# EAGLE design octanis_eps_mcu_shdn (EAGLE 7.1.0)
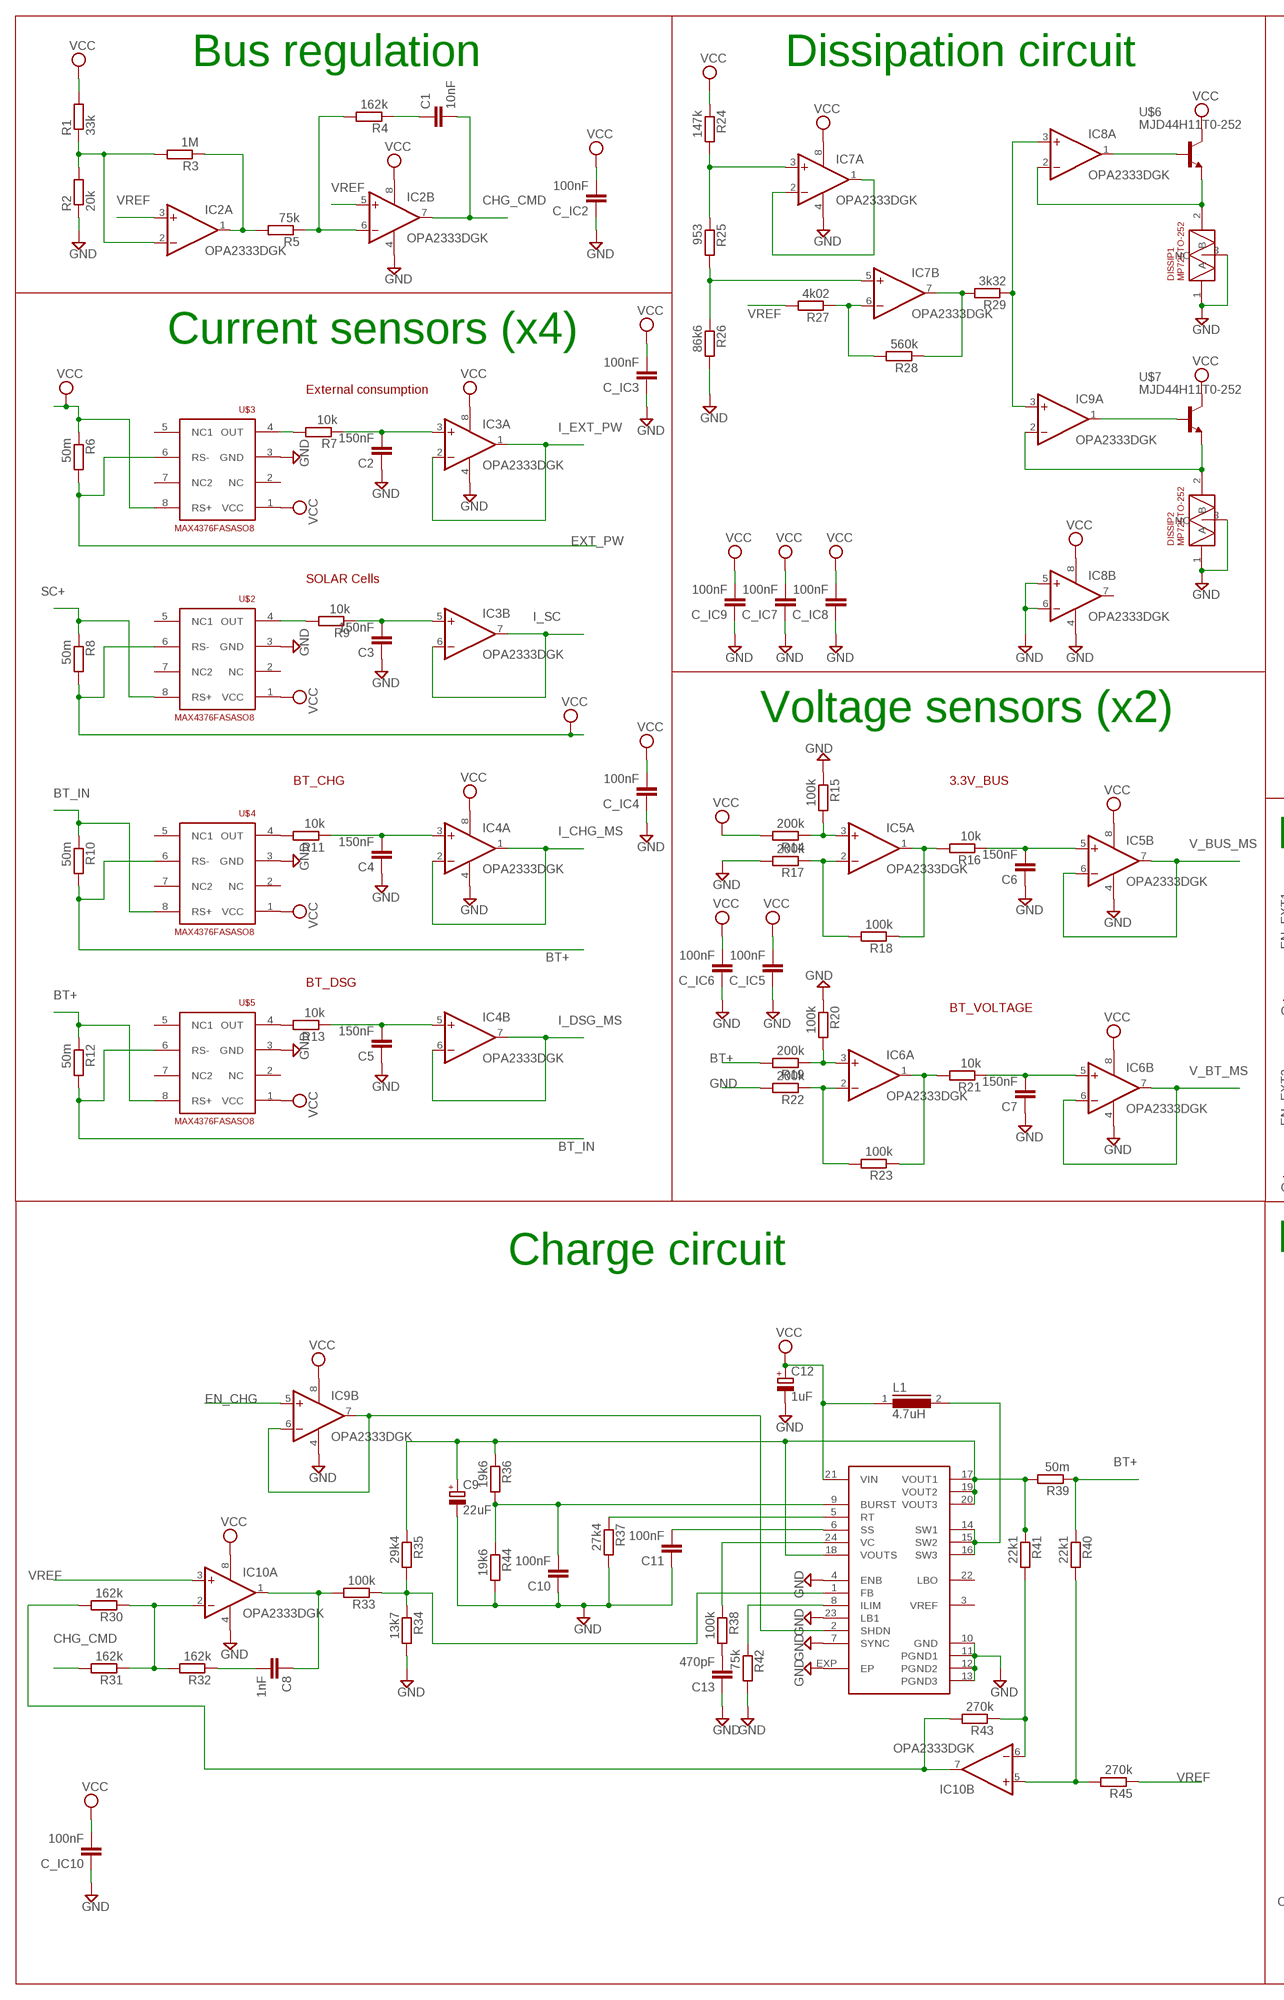
[diagram p0: schematic, sheet 1, part 1 of 2]
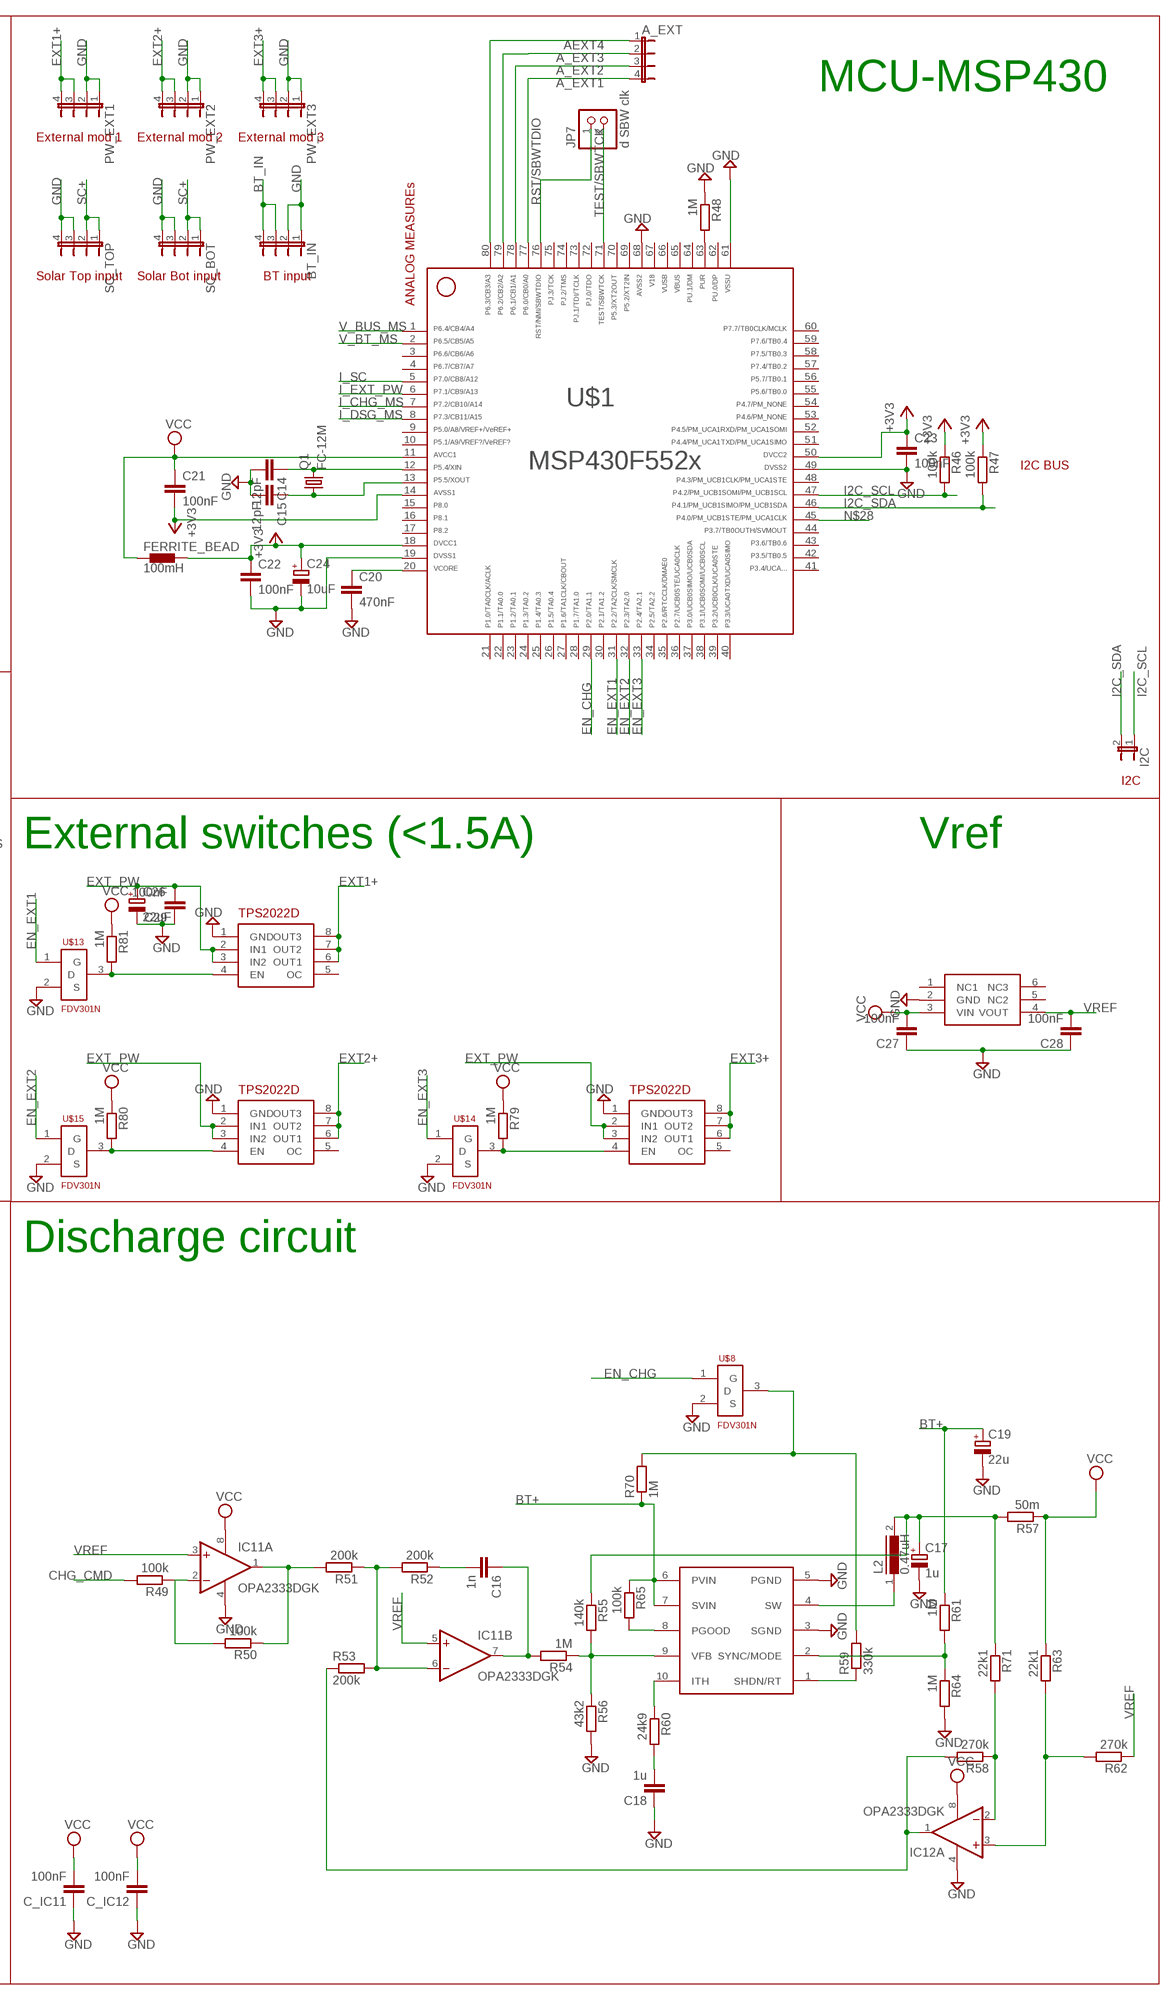
[diagram p1: schematic, sheet 1, part 2 of 2]

## Parts
A_EXT  JP4E  [JP4]
BT_IN  JP4E  [JP4]
C1  10nF  C-EUC0603  [C0603]
C2  150nF  C-EUC0603  [C0603]
C3  150nF  C-EUC0603  [C0603]
C4  150nF  C-EUC0603  [C0603]
C5  150nF  C-EUC0603  [C0603]
C6  150nF  C-EUC0603  [C0603]
C7  150nF  C-EUC0603  [C0603]
C8  1nF  C-EUC0603  [C0603]
C9  22uF  CPOL-EUA/3216-18R  [A/3216-18R]
C10  100nF  C-EUC0603  [C0603]
C11  100nF  C-EUC0603  [C0603]
C12  1uF  CPOL-EUA/3216-18R  [A/3216-18R]
C13  470pF  C-EUC0603  [C0603]
C14  12pF  C-EUC0603  [C0603]
C15  12pF  C-EUC0603  [C0603]
C16  1n  C-EUC0603  [C0603]
C17  1u  CPOL-EUA/3216-18R  [A/3216-18R]
C18  1u  C-EUC0603  [C0603]
C19  22u  CPOL-EUA/3216-18R  [A/3216-18R]
C20  470nF  C-EUC0603  [C0603]
C21  100nF  C-EUC0603  [C0603]
C22  100nF  C-EUC0603  [C0603]
C23  100nF  C-EUC0603  [C0603]
C24  10uF  CPOL-EUA/3216-18R  [A/3216-18R]
C26  22uF  CPOL-EUA/3216-18R  [A/3216-18R]
C27  100nF  C-EUC0603  [C0603]
C28  100nF  C-EUC0603  [C0603]
C29  100nF  C-EUC0603  [C0603]
C_IC2  100nF  C-EUC0603  [C0603]
C_IC3  100nF  C-EUC0603  [C0603]
C_IC4  100nF  C-EUC0603  [C0603]
C_IC5  100nF  C-EUC0603  [C0603]
C_IC6  100nF  C-EUC0603  [C0603]
C_IC7  100nF  C-EUC0603  [C0603]
C_IC8  100nF  C-EUC0603  [C0603]
C_IC9  100nF  C-EUC0603  [C0603]
C_IC10  100nF  C-EUC0603  [C0603]
C_IC11  100nF  C-EUC0603  [C0603]
C_IC12  100nF  C-EUC0603  [C0603]
DISSIP1  MP725TO-252  [TO252]
DISSIP2  MP725TO-252  [TO252]
FERRITE_BEAD  100mH  BLM15HD601SN1  [0402]
I2C  JP1E  [JP1]
IC2  OPA2333DGK  [MSOP08]
IC3  OPA2333DGK  [MSOP08]
IC4  OPA2333DGK  [MSOP08]
IC5  OPA2333DGK  [MSOP08]
IC6  OPA2333DGK  [MSOP08]
IC7  OPA2333DGK  [MSOP08]
IC8  OPA2333DGK  [MSOP08]
IC9  OPA2333DGK  [MSOP08]
IC10  OPA2333DGK  [MSOP08]
IC11  OPA2333DGK  [MSOP08]
IC12  OPA2333DGK  [MSOP08]
JP7  d SBW clk  PINHD-1X2  [1X02]
L1  4.7uH  DR73  [DR73]
L2  0.47uH  DR73  [DR73]
LTC3411  LT3411  [MSOP10]
PW_EXT1  JP4E  [JP4]
PW_EXT2  JP4E  [JP4]
PW_EXT3  JP4E  [JP4]
Q1  FC-12M  [FC-12M]
R1  33k  R-EU_R0603  [R0603]
R2  20k  R-EU_R0603  [R0603]
R3  1M  R-EU_R0603  [R0603]
R4  162k  R-EU_R0603  [R0603]
R5  75k  R-EU_R0603  [R0603]
R6  50m  R-EU_R1206  [R1206]
R7  10k  R-EU_R0603  [R0603]
R8  50m  R-EU_R1206  [R1206]
R9  10k  R-EU_R0603  [R0603]
R10  50m  R-EU_R1206  [R1206]
R11  10k  R-EU_R0603  [R0603]
R12  50m  R-EU_R1206  [R1206]
R13  10k  R-EU_R0603  [R0603]
R14  200k  R-EU_R0603  [R0603]
R15  100k  R-EU_R0603  [R0603]
R16  10k  R-EU_R0603  [R0603]
R17  200k  R-EU_R0603  [R0603]
R18  100k  R-EU_R0603  [R0603]
R19  200k  R-EU_R0603  [R0603]
R20  100k  R-EU_R0603  [R0603]
R21  10k  R-EU_R0603  [R0603]
R22  200k  R-EU_R0603  [R0603]
R23  100k  R-EU_R0603  [R0603]
R24  147k  R-EU_R0603  [R0603]
R25  953  R-EU_R0603  [R0603]
R26  86k6  R-EU_R0603  [R0603]
R27  4k02  R-EU_R0603  [R0603]
R28  560k  R-EU_R0603  [R0603]
R29  3k32  R-EU_R0603  [R0603]
R30  162k  R-EU_R0603  [R0603]
R31  162k  R-EU_R0603  [R0603]
R32  162k  R-EU_R0603  [R0603]
R33  100k  R-EU_R0603  [R0603]
R34  13k7  R-EU_R0603  [R0603]
R35  29k4  R-EU_R0603  [R0603]
R36  19k6  R-EU_R0603  [R0603]
R37  27k4  R-EU_R0603  [R0603]
R38  100k  R-EU_R0603  [R0603]
R39  50m  R-EU_R1206  [R1206]
R40  22k1  R-EU_R0603  [R0603]
R41  22k1  R-EU_R0603  [R0603]
R42  75k  R-EU_R0603  [R0603]
R43  270k  R-EU_R0603  [R0603]
R44  19k6  R-EU_R0603  [R0603]
R45  270k  R-EU_R0603  [R0603]
R46  100k  R-EU_R0603  [R0603]
R47  100k  R-EU_R0603  [R0603]
R48  1M  R-EU_R0603  [R0603]
R49  100k  R-EU_R0603  [R0603]
R50  100k  R-EU_R0603  [R0603]
R51  200k  R-EU_R0603  [R0603]
R52  200k  R-EU_R0603  [R0603]
R53  200k  R-EU_R0603  [R0603]
R54  1M  R-EU_R0603  [R0603]
R55  140k  R-EU_R0603  [R0603]
R56  43k2  R-EU_R0603  [R0603]
R57  50m  R-EU_R1206  [R1206]
R58  270k  R-EU_R0603  [R0603]
R59  330k  R-EU_R0603  [R0603]
R60  24k9  R-EU_R0603  [R0603]
R61  1M  R-EU_R0603  [R0603]
R62  270k  R-EU_R0603  [R0603]
R63  22k1  R-EU_R0603  [R0603]
R64  1M  R-EU_R0603  [R0603]
R65  100k  R-EU_R0603  [R0603]
R70  1M  R-EU_R0603  [R0603]
R71  22k1  R-EU_R0603  [R0603]
R79  1M  R-EU_R0603  [R0603]
R80  1M  R-EU_R0603  [R0603]
R81  1M  R-EU_R0603  [R0603]
SC_BOT  JP4E  [JP4]
SC_TOP  JP4E  [JP4]
U$1  F552X---PN80  [PN80]
U$2  MAX4376FASASO8  [SO8]
U$3  MAX4376FASASO8  [SO8]
U$4  MAX4376FASASO8  [SO8]
U$5  MAX4376FASASO8  [SO8]
U$6  MJD44H11T0-252  [TO252]
U$7  MJD44H11T0-252  [TO252]
U$8  FDV301N  [SOT23]
U$11  LTC3421  [QFN24]
U$13  FDV301N  [SOT23]
U$14  FDV301N  [SOT23]
U$15  FDV301N  [SOT23]
U$16  TPS2022D  [SO8]
U$17  TPS2022D  [SO8]
U$18  TPS2022D  [SO8]
U$19  ADR127B  [TSOT23-6]

## Nets
+3V3: C21.2 C22.1 C23.1 C24.+ FERRITE_BEAD.2 R46.1 R47.1 U$1.14 U$1.18 U$1.50
A_EXT1: A_EXT.4 U$1.77
A_EXT2: A_EXT.3 U$1.78
A_EXT3: A_EXT.2 U$1.79
AEXT4: A_EXT.1 U$1.80
BT+: C19.+ LTC3411.6(PVIN) LTC3411.7(SVIN) R10.2 R12.1 R19.2 R39.1 R40.1 R61.1 R65.1 R70.1 U$4.6(RS-) U$5.8(RS+)
BT_IN: BT_IN.3 BT_IN.4 R10.1 R12.2 U$4.8(RS+) U$5.6(RS-)
CHG_CMD: C1.2 IC2.7(B:OUT) R31.2 R49.2
EN_CHG: IC9.5(B:+IN) U$1.29 U$8.1(G)
EN_EXT1: U$1.31 U$13.1(G)
EN_EXT2: U$1.32 U$15.1(G)
EN_EXT3: U$1.33 U$14.1(G)
EXT1+: PW_EXT1.3 PW_EXT1.4 U$16.6(OUT1) U$16.7(OUT2) U$16.8(OUT3)
EXT2+: PW_EXT2.3 PW_EXT2.4 U$17.6(OUT1) U$17.7(OUT2) U$17.8(OUT3)
EXT3+: PW_EXT3.3 PW_EXT3.4 U$18.6(OUT1) U$18.7(OUT2) U$18.8(OUT3)
EXT_PW: C26.+ C29.2 R6.2 U$3.6(RS-) U$16.2(IN1) U$16.3(IN2) U$17.2(IN1) U$17.3(IN2) U$18.2(IN1) U$18.3(IN2)
GND: BT_IN.1 BT_IN.2 C2.1 C3.1 C4.1 C5.1 C6.1 C7.1 C9.- C10.1 C11.1 C12.- C13.1 C14.2 C15.2 C17.- C18.1 C19.- C20.2 C22.2 C23.2 C24.- C26.- C27.1 C28.1 C29.1 C_IC2.1 C_IC3.1 C_IC4.1 C_IC5.1 C_IC6.1 C_IC7.1 C_IC8.1 C_IC9.1 C_IC10.1 C_IC11.1 C_IC12.1 DISSIP1.1(A) DISSIP1.3(NC) DISSIP2.1(A) DISSIP2.3(NC) IC2.4(P:V-) IC3.4(P:V-) IC4.4(P:V-) IC5.4(P:V-) IC6.4(P:V-) IC7.4(P:V-) IC8.4(P:V-) IC8.5(B:+IN) IC8.6(B:-IN) IC9.4(P:V-) IC10.4(P:V-) IC11.4(P:V-) IC12.4(P:V-) LTC3411.3(SGND) LTC3411.5(PGND) PW_EXT1.1 PW_EXT1.2 PW_EXT2.1 PW_EXT2.2 PW_EXT3.1 PW_EXT3.2 R2.1 R15.1 R17.2 R20.1 R22.2 R26.2 R34.2 R37.2 R42.2 R44.2 R48.1 R56.2 R64.2 SC_BOT.3 SC_BOT.4 SC_TOP.3 SC_TOP.4 U$1.19 U$1.49 U$1.61 U$1.68 U$2.3(GND) U$3.3(GND) U$4.3(GND) U$5.3(GND) U$8.2(S) U$11.4(ENB) U$11.7(SYNC) U$11.10(GND) U$11.11(PGND1) U$11.12(PGND2) U$11.13(PGND3) U$11.23(LB1) U$11.EXP(EP) U$13.2(S) U$14.2(S) U$15.2(S) U$16.1(GND) U$17.1(GND) U$18.1(GND) U$19.2(GND)
I2C_SCL: I2C.1 R46.2 U$1.47
I2C_SDA: I2C.2 R47.2 U$1.46
I_CHG_MS: IC4.1(A:OUT) IC4.2(A:-IN) U$1.7
I_DSG_MS: IC4.6(B:-IN) IC4.7(B:OUT) U$1.8
I_EXT_PW: IC3.1(A:OUT) IC3.2(A:-IN) U$1.6
I_SC: IC3.6(B:-IN) IC3.7(B:OUT) U$1.5
N$1: IC2.2(A:-IN) R1.1 R2.2 R3.2
N$2: IC2.1(A:OUT) R3.1 R5.2
N$3: C1.1 R4.1
N$4: IC2.6(B:-IN) R4.2 R5.1
N$5: C4.2 IC4.3(A:+IN) R11.1
N$6: C2.2 IC3.3(A:+IN) R7.1
N$7: C3.2 IC3.5(B:+IN) R9.1
N$8: C5.2 IC4.5(B:+IN) R13.1
N$9: C7.2 IC6.5(B:+IN) R21.1
N$10: IC6.1(A:OUT) R21.2 R23.1
N$11: C6.2 IC5.5(B:+IN) R16.1
N$12: IC5.1(A:OUT) R16.2 R18.1
N$13: IC5.2(A:-IN) R17.1 R18.2
N$14: IC5.3(A:+IN) R14.1 R15.2
N$15: IC6.2(A:-IN) R22.1 R23.2
N$16: IC6.3(A:+IN) R19.1 R20.2
N$17: IC7.1(A:OUT) IC7.2(A:-IN)
N$18: IC7.3(A:+IN) R24.2 R25.1
N$19: IC7.5(B:+IN) R25.2 R26.1
N$20: IC7.6(B:-IN) R27.1 R28.2
N$21: IC7.7(B:OUT) R28.1 R29.2
N$22: IC8.3(A:+IN) IC9.3(A:+IN) R29.1
N$23: IC10.2(A:-IN) R30.1 R31.1 R32.2
N$24: C8.2 R32.1
N$25: C8.1 IC10.1(A:OUT) R33.2
N$26: R33.1 R34.1 R35.2 U$11.1(FB)
N$27: R48.2 U$1.63
N$28: U$1.45
N$29: R42.1 U$11.8(ILIM)
N$30: C10.2 R36.2 R44.1 U$11.9(BURST)
N$31: C13.2 R38.2
N$32: R37.1 U$11.5(RT)
N$33: C11.2 U$11.6(SS)
N$34: R80.2 U$15.3(D) U$17.4(EN)
N$35: C18.2 R60.2
N$36: R38.1 U$11.24(VC)
N$37: IC9.6(B:-IN) IC9.7(B:OUT) U$11.2(SHDN)
N$38: IC10.5(B:+IN) R40.2 R45.2
N$39: IC10.6(B:-IN) R41.2 R43.1
N$40: R9.2 U$2.4(OUT)
N$41: R11.2 U$4.4(OUT)
N$42: R7.2 U$3.4(OUT)
N$43: R13.2 U$5.4(OUT)
N$44: IC8.1(A:OUT) U$6.1(B)
N$45: IC9.1(A:OUT) U$7.1(B)
N$46: DISSIP2.2(B) IC9.2(A:-IN) U$7.3(E)
N$47: DISSIP1.2(B) IC8.2(A:-IN) U$6.3(E)
N$48: C14.1 Q1.2 U$1.12
N$49: C20.1 U$1.20
N$50: C15.1 Q1.1 U$1.13
N$51: C16.1 IC11.7(B:OUT) R54.2
N$52: IC11.2(A:-IN) R49.1 R50.2
N$53: IC11.1(A:OUT) R50.1 R51.2
N$54: IC11.6(B:-IN) R51.1 R52.2 R53.2
N$55: C16.2 R52.1
N$56: IC12.1(A:OUT) R53.1 R58.2
N$57: LTC3411.9(VFB) R54.1 R55.2 R56.1
N$58: C17.+ L2.2 R55.1 R57.2 R71.1
N$59: LTC3411.10(ITH) R60.1
N$60: LTC3411.2(SYNC/MODE) R61.2 R64.1
N$61: IC12.2(A:-IN) R58.1 R71.2
N$62: LTC3411.1(SHDN/RT) R59.1
N$63: IC12.3(A:+IN) R62.2 R63.2
N$64: LTC3411.8(PGOOD) R65.2
N$65: R59.2 R70.2 U$8.3(D)
N$75: C9.+ R35.1 R36.1 R39.2 R41.1 U$11.17(VOUT1) U$11.18(VOUTS) U$11.19(VOUT2) U$11.20(VOUT3)
N$77: L2.1 LTC3411.4(SW)
N$78: L1.2 U$11.14(SW1) U$11.15(SW2) U$11.16(SW3)
N$79: R81.2 U$13.3(D) U$16.4(EN)
N$80: R79.2 U$14.3(D) U$18.4(EN)
RST/SBWTDIO: JP7.1 U$1.76
SC+: R8.1 SC_BOT.1 SC_BOT.2 SC_TOP.1 SC_TOP.2 U$2.8(RS+)
TEST/SBWTCK: JP7.2 U$1.71
UUU: IC10.7(B:OUT) R30.2 R43.2
V_BT_MS: IC6.6(B:-IN) IC6.7(B:OUT) U$1.2
V_BUS_MS: IC5.6(B:-IN) IC5.7(B:OUT) U$1.1
VCC: C12.+ C21.1 C27.2 C_IC2.2 C_IC3.2 C_IC4.2 C_IC5.2 C_IC6.2 C_IC7.2 C_IC8.2 C_IC9.2 C_IC10.2 C_IC11.2 C_IC12.2 FERRITE_BEAD.1 IC2.8(P:V+) IC3.8(P:V+) IC4.8(P:V+) IC5.8(P:V+) IC6.8(P:V+) IC7.8(P:V+) IC8.8(P:V+) IC9.8(P:V+) IC10.8(P:V+) IC11.8(P:V+) IC12.8(P:V+) L1.1 R1.2 R6.1 R8.2 R14.2 R24.1 R57.1 R63.1 R79.1 R80.1 R81.1 U$1.11 U$2.1(VCC) U$2.6(RS-) U$3.1(VCC) U$3.8(RS+) U$4.1(VCC) U$5.1(VCC) U$6.2(C) U$7.2(C) U$11.21(VIN) U$19.3(VIN)
VREF: C28.2 IC2.3(A:+IN) IC2.5(B:+IN) IC10.3(A:+IN) IC11.3(A:+IN) IC11.5(B:+IN) R27.2 R45.1 R62.1 U$19.4(VOUT)
Unconnected: IC8.7(B:OUT) IC12.5(B:+IN) IC12.6(B:-IN) IC12.7(B:OUT) U$1.3 U$1.4 U$1.9 U$1.10 U$1.15 U$1.16 U$1.17 U$1.21 U$1.22 U$1.23 U$1.24 U$1.25 U$1.26 U$1.27 U$1.28 U$1.30 U$1.34 U$1.35 U$1.36 U$1.37 U$1.38 U$1.39 U$1.40 U$1.41 U$1.42 U$1.43 U$1.44 U$1.48 U$1.51 U$1.52 U$1.53 U$1.54 U$1.55 U$1.56 U$1.57 U$1.58 U$1.59 U$1.60 U$1.62 U$1.64 U$1.69 U$1.70 U$1.72 U$1.73 U$1.74 U$1.75 U$2.2(NC) U$2.5(NC1) U$2.7(NC2) U$3.2(NC) U$3.5(NC1) U$3.7(NC2) U$4.2(NC) U$4.5(NC1) U$4.7(NC2) U$5.2(NC) U$5.5(NC1) U$5.7(NC2) U$11.3(VREF) U$11.22(LBO) U$16.5(OC) U$17.5(OC) U$18.5(OC) U$19.1(NC1) U$19.5(NC2) U$19.6(NC3)

## Notes on the sheet
- Bus regulation | Dissipation circuit
- MCU-MSP430
- External mod 1 | External mod 2 | External mod 3
- Solar Top input | Solar Bot input | BT input
- ANALOG MEASUREs
- Current sensors (x4)
- External consumption
- I2C BUS
- SOLAR Cells
- Voltage sensors (x2)
- BT_CHG | 3.3V_BUS | I2C
- External switches (<1.5A) | Vref
- BT_DSG
- BT_VOLTAGE
- Charge circuit | Discharge circuit

## Power pins joined to a net without a drawn wire
65: U$1.65
66: U$1.66
67: U$1.67

## Library data of the parts
A_EXT BT_IN PW_EXT1-PW_EXT3 SC_BOT SC_TOP = jumper:JP4E: JUMPER
C1-C8 C10 C11 C13-C16 C18 C20-C23 C27-C29 C_IC2-C_IC12 = rcl:C-EU: CAPACITOR, European symbol
C9 C12 C17 C19 C24 C26 = rcl:CPOL-EU: POLARIZED CAPACITOR, European symbol
DISSIP1 DISSIP2 = Octanis1_EPS:MP725
FERRITE_BEAD = inductors:BLM15H: EMIFIL (R) Chip Ferrite Bead for GHz Noise Source: http://www.murata.com/ Ferrite Bead BLM15H.pdf
I2C = jumper:JP1E: JUMPER
IC2-IC12 = linear:OPA2333: DUAL 1.8V, microPOWER CMOS OPERATIONAL AMPLIFIERS Zerø-Drift Series Source: Texas Instruments (Burr-Brown) .. U11 opa333 Operational Amp.pdf
JP7 = pinhead:PINHD-1X2: PIN HEADER
L1 L2 = inductors:DR73: High Power Density, High Efficiency, Shielded Inductors Source: coiltronics_dr_series.pdf
LTC3411 = Octanis1_EPS:LT3411: LINEAR TECHNOLOGY - LTC3411AEMS#PBF - CONV. BUCK SYNCH 1.25A 4MHZ 10MSOP
Q1 = crystal:FC-12M: kHz RANGE CRYSTAL UNIT LOW PROFILE SMD Source: Epson Toyocom FC-12M.pdf
R1-R65 R70 R71 R79-R81 = rcl:R-EU_: RESISTOR, European symbol
U$1 = TI_MSP430_v16:F552X---PN80: ***MSP430F552X***PN80 http://www.ti.com/lit/gpn/msp430f5529 Rev1.0 06/2010 For F552X where X is 1,5,7,9
U$2-U$5 = Octanis1_EPS:MAX4376FASA: MAX4376/MAX4377/ MAX4378 Single/Dual/Quad, High-Side Current-Sense Amplifiers with Internal Gain
U$6 U$7 = Octanis1_EPS:MJD44H11: MJD44H11, MJD45H11 Complementary power transistors
U$8 U$13-U$15 = Octanis1_EPS:FDV301N: FDV301N Digital FET ,N-Channel
U$11 = Octanis1_EPS:LTC3421: 3A, 3MHz Micropower Synchronous Boost Converter with Output Disconnect
U$16-U$18 = Octanis1_EPS:TPS2022D: TEXAS INSTRUMENTS - TPS2022D - IC, 1.5A PWR DIST SWITCH 8SOIC
U$19 = Octanis1_EPS:ADR127B: ANALOG DEVICES - ADR127BUJZ-REEL7 - VOLTAGE REFERENCE, SERIES, 3.3V, TSOT-6

## Net classes
0 default: clearance 0.205 mm

## Board
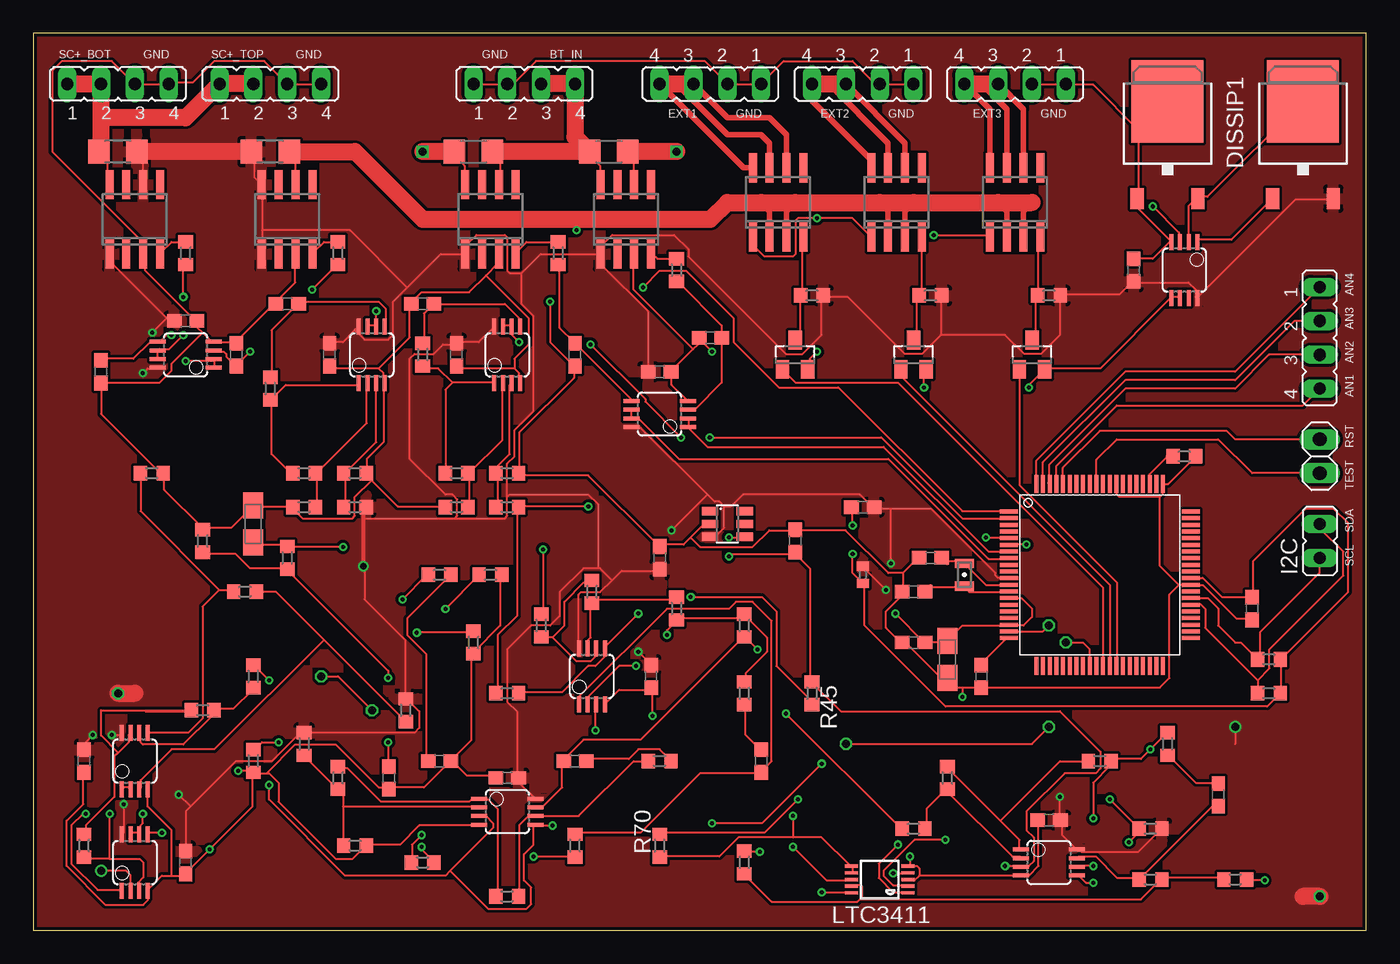
[diagram p2: board, top side]
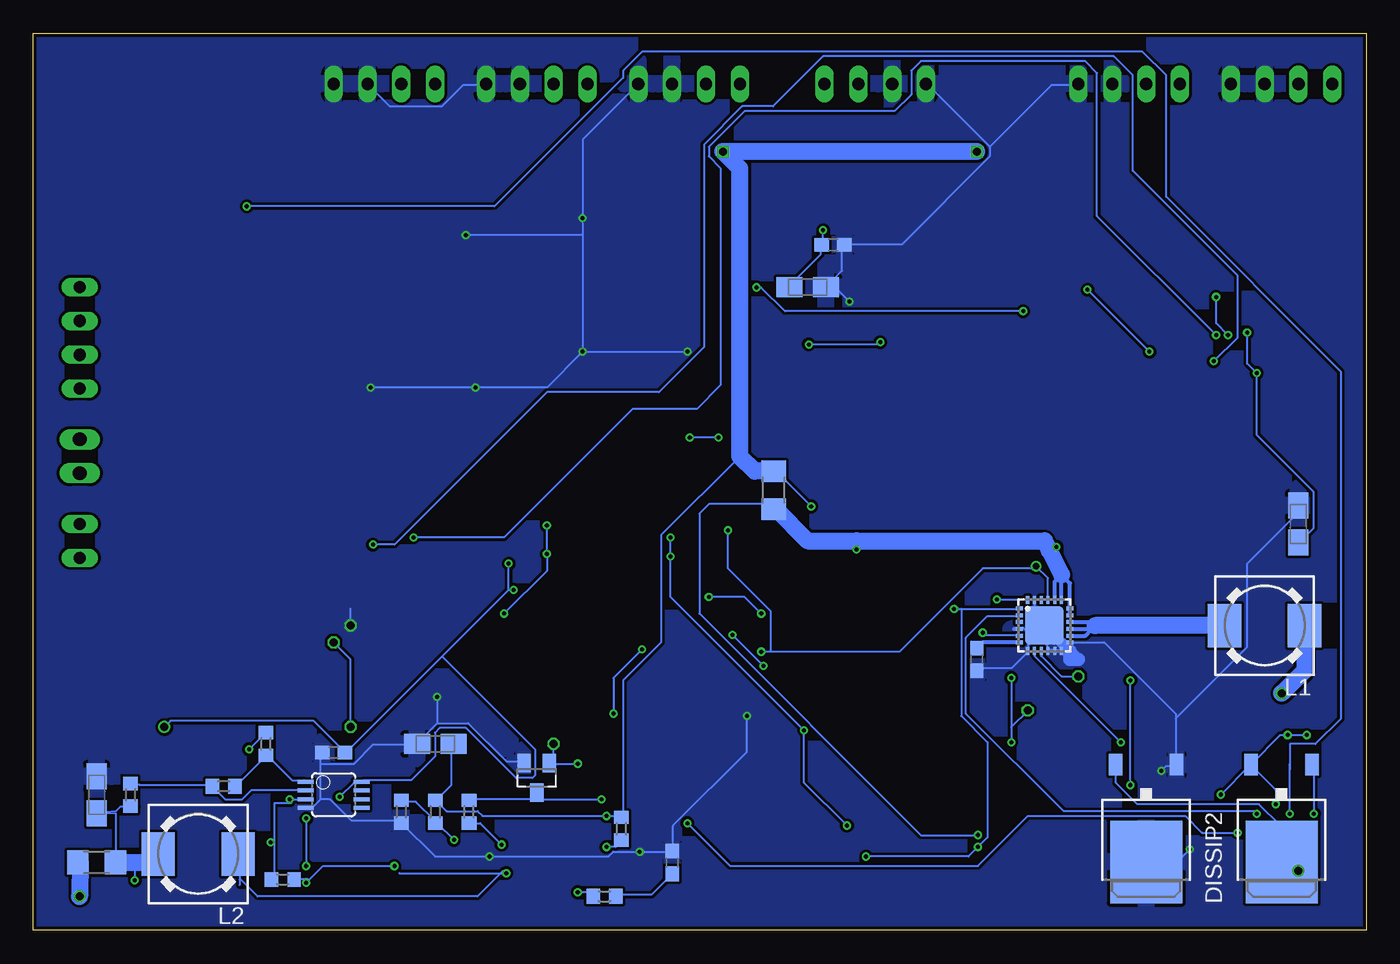
[diagram p3: board, bottom side, seen from below]

Size 100 x 67.3 mm. Coordinates in mm from the lower left corner, seen from the top.
Outline: 0,0 100,0 100,67.3 0,67.3 0,0
Copper layers (1*2*15*16): Top 0.035mm / dielectric 0.2mm / layer 2 0.0175mm / dielectric 1.1mm / layer 15 0.0175mm / dielectric 0.2mm / Bottom 0.035mm
Design rules "SeeedStudio_DRU_no_angle_20130527": minimum track width 6mil, minimum drill 12mil, track to track 6mil, track to pad 6mil, pad to pad 6mil, via to via 6mil, smd to smd 0mil, copper to edge 10mil, drill to drill 10mil, minimum pad ring 6mil, minimum via ring 6mil, stop-mask expansion 2mil, vias tented up to drill 25mil, thermal gap 10mil

### Footprints (pad centres in the part's own frame; a part is rotated, then mirrored left to right if it is on the bottom)
JP4 = drill 0.914 long: 1 -3.81,0; 2 -1.27,0; 3 1.27,0; 4 3.81,0
C0603 = smd 1.1 x 1: 1 -0.85,0; 2 0.85,0
A/3216-18R = smd 1.95 x 1.5: + 1.375,0; - -1.375,0
TO252 = smd 1 x 1.6: 1 -2.28,-4.8; 2 2.28,-4.8 | smd 5.4 x 6.2: 3 0,2.5
0402 = smd 0.7 x 0.9: 1 -0.65,0; 2 0.65,0
JP1 = drill 0.914 long: 1 0,-1.27; 2 0,1.27
MSOP08 = smd 0.3 x 1.2: 1 -0.976,-2.113; 2 -0.326,-2.113; 3 0.324,-2.113; 4 0.974,-2.113; 5 0.974,2.112; 6 0.324,2.112; 7 -0.326,2.112; 8 -0.976,2.112
1X02 = drill 1.016 long: 1 -1.27,0; 2 1.27,0
DR73 = smd 2.5 x 3.25: 1 -3,0; 2 3,0
MSOP10 = smd 0.25 x 1: 1 -1,-2.113; 2 -0.5,-2.113; 3 0,-2.113; 4 0.5,-2.113; 5 1,-2.113; 6 1,2.113; 7 0.5,2.113; 8 0,2.113; 9 -0.5,2.113; 10 -1,2.113
FC-12M = smd 0.7 x 1.4: 1 -0.85,0; 2 0.85,0
R0603 = smd 1 x 1.1: 1 -0.85,0; 2 0.85,0
R1206 = smd 1.6 x 1.803: 1 -1.422,0; 2 1.422,0
PN80 = smd 1.35 x 0.3: 1 -6.825,4.75; 2 -6.825,4.25; 3 -6.825,3.75; 4 -6.825,3.25; 5 -6.825,2.75; 6 -6.825,2.25; 7 -6.825,1.75; 8 -6.825,1.25; 9 -6.825,0.75; 10 -6.825,0.25; 11 -6.825,-0.25; 12 -6.825,-0.75; 13 -6.825,-1.25; 14 -6.825,-1.75; 15 -6.825,-2.25; 16 -6.825,-2.75; 17 -6.825,-3.25; 18 -6.825,-3.75; 19 -6.825,-4.25; 20 -6.825,-4.75; 41 6.825,-4.75; 42 6.825,-4.25; 43 6.825,-3.75; 44 6.825,-3.25; 45 6.825,-2.75; 46 6.825,-2.25; 47 6.825,-1.75; 48 6.825,-1.25; 49 6.825,-0.75; 50 6.825,-0.25; 51 6.825,0.25; 52 6.825,0.75; 53 6.825,1.25; 54 6.825,1.75; 55 6.825,2.25; 56 6.825,2.75; 57 6.825,3.25; 58 6.825,3.75; 59 6.825,4.25; 60 6.825,4.75 | smd 0.3 x 1.35: 21 -4.75,-6.825; 22 -4.25,-6.825; 23 -3.75,-6.825; 24 -3.25,-6.825; 25 -2.75,-6.825; 26 -2.25,-6.825; 27 -1.75,-6.825; 28 -1.25,-6.825; 29 -0.75,-6.825; 30 -0.25,-6.825; 31 0.25,-6.825; 32 0.75,-6.825; 33 1.25,-6.825; 34 1.75,-6.825; 35 2.25,-6.825; 36 2.75,-6.825; 37 3.25,-6.825; 38 3.75,-6.825; 39 4.25,-6.825; 40 4.75,-6.825; 61 4.75,6.825; 62 4.25,6.825; 63 3.75,6.825; 64 3.25,6.825; 65 2.75,6.825; 66 2.25,6.825; 67 1.75,6.825; 68 1.25,6.825; 69 0.75,6.825; 70 0.25,6.825; 71 -0.25,6.825; 72 -0.75,6.825; 73 -1.25,6.825; 74 -1.75,6.825; 75 -2.25,6.825; 76 -2.75,6.825; 77 -3.25,6.825; 78 -3.75,6.825; 79 -4.25,6.825; 80 -4.75,6.825
SO8 = smd 0.6 x 2.2: 1 -1.905,-2.6; 2 -0.635,-2.6; 3 0.635,-2.6; 4 1.905,-2.6; 5 1.905,2.6; 6 0.635,2.6; 7 -0.635,2.6; 8 -1.905,2.6
SOT23 = smd 1 x 1.4: 1 -0.95,-1.1; 2 0.95,-1.1; 3 0,1.1
QFN24 = smd 0.6 x 0.3: 1 -1.905,1.27; 2 -1.905,0.762; 3 -1.905,0.254; 4 -1.905,-0.254; 5 -1.905,-0.762; 6 -1.905,-1.27; 13 1.905,-1.27; 14 1.905,-0.762; 15 1.905,-0.254; 16 1.905,0.254; 17 1.905,0.762; 18 1.905,1.27 | smd 0.3 x 0.6: 7 -1.27,-1.905; 8 -0.762,-1.905; 9 -0.254,-1.905; 10 0.254,-1.905; 11 0.762,-1.905; 12 1.27,-1.905; 19 1.27,1.905; 20 0.762,1.905; 21 0.254,1.905; 22 -0.254,1.905; 23 -0.762,1.905; 24 -1.27,1.905 | smd 2.9 x 2.9: EXP 0,0
TSOT23-6 = smd 0.62 x 1.22: 1 -0.95,-1.3; 2 0,-1.3; 3 0.95,-1.3; 4 0.95,1.3; 5 0,1.3; 6 -0.95,1.3

### Placement (x,y rotation side)
A_EXT  96.52,44.45 270 top
BT_IN  36.83,63.5 0 top
C1  40.64,12.7 180 top
C2  15.24,43.18 270 top
C3  5.08,41.91 90 top
C4  50.8,44.45 0 top
C5  40.64,43.18 90 top
C6  19.05,46.99 0 top
C7  29.21,46.99 0 top
C8  54.61,12.7 90 top
C9  16.51,30.48 270 top
C10  26.67,11.43 90 top
C11  29.21,20.32 90 bottom
C12  5.08,30.48 270 bottom
C13  30.48,12.7 180 top
C14  67.31,27.94 180 top
C15  66.04,25.4 180 top
C16  88.9,10.16 90 top
C17  95.25,10.16 270 bottom
C18  52.07,5.08 270 bottom
C19  69.85,13.97 0 bottom
C20  71.12,19.05 270 top
C21  62.23,31.75 180 top
C22  66.04,21.59 180 top
C23  91.44,24.13 270 top
C24  68.58,20.32 90 top
C26  41.91,48.26 180 bottom
C27  46.99,27.94 270 top
C28  57.15,29.21 270 top
C29  40.01,51.44 180 bottom
C_IC2  35.56,11.43 0 top
C_IC3  11.43,45.72 180 top
C_IC4  46.99,41.91 180 top
C_IC5  22.23,43.18 90 top
C_IC6  31.75,43.18 90 top
C_IC7  3.81,12.7 90 top
C_IC8  82.55,49.53 270 top
C_IC9  11.43,5.08 90 top
C_IC10  46.35,19.05 90 top
C_IC11  76.2,8.25 0 top
C_IC12  77.47,13.34 0 bottom
DISSIP1  85.09,59.69 0 top
DISSIP2  16.51,7.62 180 bottom
FERRITE_BEAD  62.23,26.67 270 top
I2C  96.52,29.21 0 top
IC2  35.56,8.89 270 top
IC3  11.43,43.18 90 top
IC4  46.99,38.73 90 top
IC5  25.4,43.18 0 top
IC6  35.56,43.18 0 top
IC7  7.62,12.7 0 top
IC8  86.36,49.53 180 top
IC9  7.62,5.08 0 top
IC10  41.91,19.05 0 top
IC11  76.2,5.08 270 top
IC12  77.47,10.16 270 bottom
JP7  96.52,35.56 270 top
L1  7.62,22.86 180 bottom
L2  87.63,5.71 180 bottom
LTC3411  63.5,3.81 90 top
PW_EXT1  50.8,63.5 180 top
PW_EXT2  62.23,63.5 180 top
PW_EXT3  73.66,63.5 180 top
Q1  69.85,26.67 90 top
R1  20.32,13.97 90 top
R2  24.13,6.35 180 top
R3  22.86,11.43 270 top
R4  46.99,12.7 180 top
R5  35.56,2.54 180 top
R6  17.78,58.42 0 top
R7  22.86,50.8 90 top
R8  6.35,58.42 0 top
R9  11.43,50.8 90 top
R10  33.02,58.42 180 top
R11  48.26,49.53 90 top
R12  43.18,58.42 180 top
R13  39.37,50.8 90 top
R14  24.13,31.75 0 top
R15  24.13,34.29 180 top
R16  17.78,40.64 270 top
R17  20.32,31.75 180 top
R18  20.32,34.29 0 top
R19  35.56,31.75 0 top
R20  35.56,34.29 180 top
R21  29.21,43.18 270 top
R22  31.75,31.75 180 top
R23  31.75,34.29 0 top
R24  27.94,16.51 270 top
R25  15.88,25.4 180 top
R26  8.89,34.29 0 top
R27  16.51,19.05 90 top
R28  12.7,16.51 0 top
R29  3.81,6.35 90 top
R30  48.26,24.13 90 top
R31  53.34,22.86 270 top
R32  53.34,17.78 90 top
R33  40.64,6.35 90 top
R34  34.29,26.67 0 top
R35  29.21,5.08 0 top
R36  19.05,27.94 270 top
R37  33.02,21.59 270 top
R38  30.48,26.67 0 top
R39  44.45,33.02 270 bottom
R40  35.56,17.78 0 top
R41  38.1,22.86 270 top
R42  16.51,12.7 270 top
R43  41.91,25.4 270 top
R44  12.7,29.21 90 top
R45  58.42,17.78 270 top
R46  92.71,20.32 180 top
R47  92.71,17.78 180 top
R48  86.36,35.56 180 top
R49  66.04,7.62 180 top
R50  68.58,11.43 270 top
R51  80.01,12.7 180 top
R52  85.09,13.97 90 top
R53  82.55,13.97 90 bottom
R54  83.82,3.81 180 top
R55  90.17,3.81 180 top
R56  53.34,5.08 90 top
R57  95.25,5.08 0 bottom
R58  85.72,10.8 0 bottom
R59  67.31,8.89 90 bottom
R60  57.15,2.54 0 bottom
R61  69.85,8.89 270 bottom
R62  81.28,3.81 180 bottom
R63  83.82,7.62 180 top
R64  72.39,8.89 270 bottom
R65  55.88,7.62 270 bottom
R70  46.99,6.35 90 top
R71  92.71,10.16 90 bottom
R79  76.2,47.62 180 top
R80  67.31,47.62 180 top
R81  58.42,47.62 180 top
SC_BOT  6.35,63.5 0 top
SC_TOP  17.78,63.5 0 top
U$1  80.01,26.67 0 top
U$2  7.62,53.34 0 top
U$3  19.05,53.34 0 top
U$4  44.45,53.34 0 top
U$5  34.29,53.34 0 top
U$6  95.25,59.69 0 top
U$7  6.35,7.62 180 bottom
U$8  62.23,11.43 180 bottom
U$11  24.13,22.86 0 bottom
U$13  57.15,43.18 0 top
U$14  74.93,43.18 0 top
U$15  66.04,43.18 0 top
U$16  55.88,54.61 0 top
U$17  64.77,54.61 0 top
U$18  73.66,54.61 0 top
U$19  52.07,30.48 270 top

### Tracks (layer width: path | path; a pad name or v marks a point on that pad's centre or on a via)
+3V3  (via drill 0.3)
  Top 0.152: U$1.50 86.85,26.43 87.74,26.43 89.17,25.01 91.32,25.01 C23.1 91.49,25.01 91.49,27.69 95.43,31.62 97.57,31.62 98.64,30.54 98.64,25.36 93.64,20.36 R46.1 93.64,20.18 93.64,17.86 R47.1 93.46,17.68 92.57,16.79 68.44,16.79 62.37,22.86 62.37,25.9 FERRITE_BEAD.2 62.19,26.08 61.47,26.79 v61.47,28.22 | v61.47,30.37 61.47,31.62 C21.2 | v64.69,23.75 66.83,21.61 C22.1 67.01,21.61 68.44,21.61 C24.+ 68.62,21.79 69.69,22.86 73.09,22.86 U$1.18 73.25,22.86 74.3,22.86 74.93,23.5 74.93,24.13 74.14,24.92 U$1.14
  Bottom 0.152: v61.47,30.37 v61.47,28.22 61.47,26.97 v64.69,23.75
A_EXT1
  Top 0.152: U$1.77 76.76,34.85 81.28,39.37 95.25,39.37 A_EXT.4
A_EXT2
  Top 0.152: A_EXT.3 92.71,43.18 90.17,40.64 81.92,40.64 76.2,34.92 76.2,33.56
  Top 0.254: 76.2,33.56 U$1.78
A_EXT3
  Top 0.152: U$1.79 75.76,35.12 81.92,41.28 90.17,41.28 94.61,45.72 A_EXT.2
AEXT4
  Top 0.152: A_EXT.1 90.17,41.91 81.92,41.91 75.26,35.25 U$1.80
BT+  (via drill 0.3, 0.6)
  Top 0.152: LTC3411.7 61.47,4.28 61.47,4.81 LTC3411.6 61.29,4.81 59.15,6.96 57.01,6.96 | 57.01,6.96 52.9,6.96 51.47,5.53 47,5.53 R70.1 | v57.01,8.57 57.01,6.96 | R40.1 34.85,17.86 34.85,22.15 36.28,23.58 36.28,31.62 R19.2 36.45,31.8 v41.64,31.8 | U$5.8 32.34,56.1 32.34,57.35 31.81,57.89 R10.2 | U$4.6 45.03,56.1 45.03,57.89 R12.1
  Top 1.27: v48.26,58.42 R12.1 | R10.2 v29.21,58.42
  Bottom 0.152: C19.+ 68.62,13.93 68.62,10.89 69.69,9.82 R61.1 69.69,9.64 68.98,8.92 66.66,8.92 66.3,8.57 v57.01,8.57 55.93,8.57 R65.1 55.75,8.57 55.75,18.75 52.9,21.61 52.9,29.65 46.99,35.56 | v41.64,31.8 43.96,34.12 R39.1
  Bottom 1.27: R39.1 45.87,34.44 46.99,35.56 46.99,57.15 v48.26,58.42 v29.21,58.42
BT_IN
  Top 0.152: U$5.6 35.02,56.1 35.02,57.89 R10.1 | U$4.8 42.53,56.1 42.53,57.35 41.99,57.89 R12.2
  Top 1.27: BT_IN.3 BT_IN.4 40.64,59.54 R12.2 R10.1
CHG_CMD  (via drill 0.3)
  Top 0.152: IC2.7 37.71,9.28 38.24,9.28 39.67,10.71 39.67,12.68 C1.2 39.85,12.85 41.28,14.28 45.57,14.28 53.25,21.97 R31.2 53.43,21.97 v54.33,21.07 | v56.47,16.25 65.05,7.67 R49.2
  Bottom 0.152: v56.47,16.25 56.47,18.93 v54.33,21.07
EN_CHG  (via drill 0.3, 0.6)
  Top 0.152: v9.65,7.31 8.58,7.31 IC9.5 | v50.93,8.03 54.68,8.03 v59.15,12.5 | v60.96,13.97 74.93,13.97 v76.2,15.24 | v77.47,21.59 78.74,21.59 79.26,21.07 U$1.29
  Bottom 0.152: v9.65,7.31 12.33,7.31 13.58,8.57 25.38,8.57 29.13,4.81 47.71,4.81 v50.93,8.03 | v59.15,12.5 61.12,12.5 U$8.1 60.96,12.53 v60.96,13.97 | v76.2,15.24 76.2,20.32 v77.47,21.59
EN_EXT1
  Top 0.152: U$1.31 80.24,20 80.24,25.72 64.87,41.09 57.18,41.09 56.29,41.98 U$13.1
EN_EXT2
  Top 0.152: U$1.32 80.77,20 80.77,25.9 65.22,41.45 65.22,41.98 U$15.1
EN_EXT3
  Top 0.152: U$1.33 81.31,20 81.31,26.08 73.98,33.41 73.98,41.98 U$14.1
EXT1+
  Top 0.406: U$16.8 53.28,57.21 PW_EXT1.4 | U$16.7 55.24,59.05 54.61,59.69 52.07,59.69 48.26,63.5 | U$16.6 56.52,59.69 55.24,60.96 52.07,60.96 PW_EXT1.3
  Top 1.27: PW_EXT1.4 48.26,63.5 PW_EXT1.3
EXT2+
  Top 0.406: U$17.8 62.87,57.78 58.42,62.23 PW_EXT2.4 | U$17.7 64.14,59.05 59.69,63.5 | U$17.6 65.41,59.05 PW_EXT2.3
  Top 1.27: PW_EXT2.4 59.69,63.5 PW_EXT2.3
EXT3+
  Top 0.406: U$18.8 71.75,61.59 PW_EXT3.4 | U$18.7 73.03,61.59 71.12,63.5 | U$18.6 74.3,61.59 PW_EXT3.3
  Top 1.27: PW_EXT3.4 71.12,63.5 PW_EXT3.3
EXT_PW  (via drill 0.3)
  Top 0.152: U$3.6 19.66,56.1 19.66,57.89 R6.2 | v40.74,52.52 40.74,53.34
  Top 0.406: U$16.3 56.52,53.97 57.15,54.61 | U$16.2 55.24,53.97 54.61,54.61 | U$17.2 64.14,53.97 63.5,54.61 | U$17.3 65.41,53.97 66.04,54.61 | U$18.3 74.3,53.97 74.93,54.61 | U$18.2 73.03,53.97 72.39,54.61
  Top 1.27: R6.2 24.13,58.42 29.21,53.34 40.74,53.34 50.8,53.34 52.07,54.61 54.61,54.61 57.15,54.61 63.5,54.61 66.04,54.61 72.39,54.61 74.93,54.61
  Bottom 0.152: C26.+ 43.24,48.42 40.92,50.74 40.92,51.28 C29.2 40.74,51.45 v40.74,52.52
GND  (via drill 0.3, 0.6)
  Top 0.152: R48.1 85.14,33.5 U$1.61 84.7,33.41 84.7,32.69 84.53,32.51 | 66.48,4.1 66.12,3.74 65.76,3.74 LTC3411.3 | 66.48,4.1 66.48,4.63 66.3,4.81 65.76,4.81 | C_IC11.1 75.41,8.21 75.41,4.81 74.7,4.1 74.16,4.1 IC11.4 73.98,4.1 66.48,4.1 | IC10.4 42.89,16.96 43.96,18.04 46.28,18.04 C_IC10.1 46.46,18.04 v46.46,16.07 | v54.5,5.89 53.43,5.89 R56.2 | v65.76,5.53 65.76,4.81 | 65.76,4.81 LTC3411.5 | 84.53,32.51 81.49,32.51 81.31,32.69 81.31,33.41 U$1.68 | C23.2 91.32,23.4 90.24,23.4 87.74,25.9 86.85,25.9 U$1.49 86.67,25.9 85.95,25.9 | 84.53,32.51 84.53,27.33 85.95,25.9 | 49.32,29.47 50.22,30.37 50.75,30.37 U$19.2 | 49.32,29.47 48.78,28.94 47,28.94 C27.1 46.82,28.94 41.64,34.12 36.45,34.12 R20.1 36.45,34.3 36.45,37.34 40.56,41.45 40.56,42.16 C5.1 40.56,42.34 38.78,44.13 v38.78,47.16 | 49.32,29.47 50.04,28.76 53.97,28.76 55.22,30.01 57.01,30.01 C28.1 57.18,30.01 60.94,30.01 64.15,26.79 65.22,26.79 | 65.22,26.79 65.22,25.54 C15.2 65.05,25.36 65.05,25.01 63.98,23.93 63.98,22.68 65.05,21.61 C22.2 65.22,21.43 65.58,21.43 67.91,19.11 68.44,19.11 C24.- 68.62,18.93 69.34,18.21 69.69,18.21 | 65.22,26.79 66.3,27.86 C14.2 | 69.69,18.21 70.94,18.21 C20.2 71.12,18.21 84.53,18.21 85.24,18.93 85.24,25.18 85.95,25.9 | 69.69,18.21 v69.69,17.5 | R34.2 35.02,26.61 35.02,22.86 33.06,20.9 R37.2 32.88,20.72 32.88,14.28 31.45,12.85 C13.1 | C13.1 31.27,12.68 29.31,10.71 26.8,10.71 C10.1 26.63,10.71 25.91,10.71 22.7,13.93 19.66,13.93 17.51,11.78 | C_IC2.1 34.67,11.6 32.52,11.6 31.45,12.68 C13.1 | IC2.4 33.42,7.85 28.95,7.85 27.52,6.42 25.02,6.42 R2.1 24.84,6.24 23.95,5.35 22.7,5.35 18.41,9.64 18.41,11.07 17.69,11.78 17.51,11.78
  Top 0.152: 10.37,4.1 9.65,4.1 8.58,3.03 IC9.4 8.58,2.85 8.58,2.23 8.26,1.91 5.41,1.91 2.5,4.81 2.5,8.21 3.75,9.46 3.75,11.78 C_IC7.1 | 10.37,4.1 11.26,4.1 C_IC9.1 11.44,4.28 v13.22,6.06 16.44,9.28 16.44,11.78 R42.2 | 10.37,4.1 10.37,7.49 8.58,9.28 8.58,10.53 IC7.4 | 17.51,11.78 16.62,11.78 R42.2 | v15.37,11.96 16.44,11.96 R42.2 | 25.38,33.76 25.02,34.12 R15.1 | 25.38,33.76 27.34,31.8 30.74,31.8 R22.2 | 36.1,42.16 31.81,42.16 C_IC6.1 | 36.1,42.16 36.45,41.8 36.45,41.09 IC6.4 | 25.91,42.16 22.34,42.16 C_IC5.1 | 25.91,42.16 26.27,41.8 26.27,41.09 IC5.4 26.27,40.91 26.27,36.62 25.02,35.37 25.02,34.3 R15.1 | 25.91,42.16 28.23,44.48 28.23,46.99 C7.1 28.41,47.16 29.13,47.88 32.7,47.88 33.95,49.13 | 33.95,49.13 34.85,50.02 34.85,50.74 U$5.3 | 36.1,42.16 36.1,42.88 37.17,43.95 37.17,45.91 33.95,49.13 | 15.19,44.13 13.58,44.13 IC3.4 13.4,44.13 12.69,44.84 | 12.69,44.84 12.33,45.2 12.33,45.56 C_IC3.1 12.15,45.73 8.4,49.49 8.4,50.74 U$2.3 8.22,50.92 8.22,51.63 1.43,58.42 1.43,64.5 2.14,65.21 5.9,65.21 7.5,63.61 SC_BOT.3 7.68,63.43 10.01,63.43 SC_BOT.4 10.19,63.61 11.97,63.61 13.58,65.21 17.33,65.21 18.94,63.61 SC_TOP.3 19.12,63.43 21.44,63.43 SC_TOP.4 | 15.19,44.13 18.05,46.99 C6.1 18.23,47.16 19.66,48.59 19.66,50.74 U$3.3 | 15.19,44.13 C2.1 | 12.69,44.84 10.37,42.52 10.37,41.98 9.47,41.09 5.18,41.09 C3.1 5.08,38.73 9.53,34.29 R26.2 9.83,34.12 9.83,33.05 12.69,30.19 R44.2 12.87,30.19 14.83,30.19 16.44,31.8 C9.- 16.62,31.8 19.3,31.8 R17.2 19.48,31.62 20.19,30.9 23.95,30.9 24.12,31.08 24.12,32.51 25.38,33.76 | 25.38,33.76 R15.1 | BT_IN.1 33.06,63.43 35.38,63.43 BT_IN.2 35.56,63.61 36.1,63.61 37.71,65.21 50.39,65.21 52,63.61 PW_EXT1.2 52.18,63.43 54.5,63.43 PW_EXT1.1 54.68,63.61 56.29,65.21 61.47,65.21 63.08,63.61 63.44,63.61 PW_EXT2.2 63.62,63.43 65.94,63.43 PW_EXT2.1
  Top 0.152: PW_EXT3.2 75.05,63.43 77.38,63.43 PW_EXT3.1 77.56,63.43 79.52,63.43 82.92,60.03 | C_IC8.1 83.99,50.38 85.24,51.63 IC8.4 85.24,51.81 82.92,54.13 82.92,54.85 DISSIP1.1 82.92,55.03 82.92,60.03 | 82.92,60.03 85.06,62.17 DISSIP1.3 82.92,60.03 | IC4.4 48.96,39.84 47.89,40.91 47.89,41.8 C_IC4.1 47.89,41.98 49.5,43.59 | 49.5,43.59 49.86,43.95 49.86,44.31 C4.1 50.04,44.31 v50.93,43.41 | 49.5,43.59 45.03,48.06 45.03,50.74 U$4.3 | IC8.6 85.95,47.52 85.42,47.52 IC8.5 85.24,47.34 80.06,42.16 75.95,42.16 U$14.2 75.77,41.98 74.7,40.91 v74.7,40.73 | U$16.1 54.15,51.99 54.15,51.28 54.86,50.56 57.01,50.56 57.18,50.74 57.18,53.24 57.36,53.42 v58.79,53.42 61.47,53.42 62.72,52.17 U$17.1 | v58.79,43.41 58.26,42.88 58.26,42.16 U$13.2 | v66.83,40.73 66.83,41.98 U$15.2 | v67.55,52.17 71.66,52.17 U$18.1 | U$1.19 75.76,22.42 v76.2,22.86
  Bottom 0.152: 69.69,15.54 67.37,15.54 64.51,12.68 63.26,12.68 U$8.2 | 69.69,15.54 71.12,14.11 C19.- 71.3,13.93 74.52,13.93 75.95,12.5 78.45,12.5 | 78.45,9.82 78.45,12.5 | 78.45,12.5 78.45,13.21 C_IC12.1 | 78.45,9.82 78.98,9.28 79.52,9.28 IC12.4 | v46.46,16.07 46.46,13.39 52,7.85 52,6.06 C18.1 52.18,5.89 v54.5,5.89 56.47,5.89 56.83,5.53 v65.76,5.53 69.87,5.53 72.37,8.03 R64.2 72.55,8.21 76.13,8.21 77.73,9.82 78.45,9.82 | v69.69,17.5 69.69,15.54 | 25.38,22.32 25.38,21.07 U$11.7 25.38,20.9 26.63,19.64 29.13,19.64 C11.1 | 25.38,22.32 25.73,22.68 25.91,22.68 U$11.4 | 24.48,23.04 24.3,22.86 U$11.EXP | 24.48,23.04 24.84,23.4 24.84,24.65 U$11.23 | U$11.10 23.95,21.07 23.95,22.5 24.12,22.68 U$11.EXP | 14.3,15.89 14.3,16.25 19.66,21.61 22.16,21.61 U$11.13 22.34,21.61 22.61,21.34 22.87,21.07 U$11.12 | 14.3,15.89 14.3,12.5 DISSIP2.1 14.3,12.32 15.01,12.32 v15.37,11.96 | 14.3,15.89 8.94,21.25 8.94,27.51 5.18,31.26 5.18,31.8 C12.- | 25.38,22.32 24.66,23.04 24.48,23.04 | 24.48,23.04 U$11.EXP | v13.22,6.06 14.12,5.17 16.44,5.17 DISSIP2.3 | 40.21,48.59 40.39,48.42 C26.- 40.21,48.59 | 40.21,48.59 39.31,49.49 39.31,51.28 C29.1 39.13,51.45 34.85,51.45 28.23,58.06 28.23,58.78 | 28.23,58.78 32.88,63.43 BT_IN.1 | 28.23,58.78 23.59,63.43 21.62,63.43 SC_TOP.4 | PW_EXT2.1 66.12,63.43 67.73,63.43 69.34,61.82 73.27,61.82 74.88,63.43 PW_EXT3.2 | 58.79,52.17 v58.79,53.42 58.79,59.32 54.68,63.43 PW_EXT1.1 | 58.79,52.17 v58.79,43.41 | v58.79,43.41 61.47,40.73 v66.83,40.73 v74.7,40.73 | 58.79,52.17 v67.55,52.17 | v58.79,43.41 v50.93,43.41 | 40.21,48.59 v38.78,47.16 | v76.2,22.86 76.2,24.13
  Bottom 0.305: U$11.10 U$11.11 U$11.12 | U$11.4 26.42,22.61
  Bottom 0.813: 22.86,21.59 22.61,21.34 21.59,20.32
  Bottom 1.016: 21.59,20.32 22.23,20.32 22.23,20.96
  pour Bottom: -1.27,67.31 100.33,67.31 100.33,0 -1.27,0 -1.27,66.04
I2C_SCL
  Top 0.152: I2C.1 96.5,27.86 96.5,26.79 92.03,22.32 92.03,20.36 R46.2 90.59,21.59 90.17,21.59 88.9,22.86 88.9,24.13 88.11,24.92 U$1.47
I2C_SDA
  Top 0.152: 91.85,18.75 91.85,17.86 R47.2 | 91.85,18.75 87.92,22.68 87.92,24.11 87.56,24.47 86.85,24.47 U$1.46 | 91.85,18.75 92.75,19.64 92.75,21.07 98.28,26.61 98.28,28.4 96.68,30.01 96.68,30.37 I2C.2
I_CHG_MS
  Top 0.152: IC4.2 49.14,38.41 49.14,37.87 IC4.1 49.14,37.69 50.57,36.26 63.8,36.26 71.66,28.4 73.09,28.4 U$1.7
I_DSG_MS
  Top 0.152: IC4.6 44.85,38.94 44.85,38.41 IC4.7 45.03,38.41 45.39,38.41 48.43,35.37 64.15,35.37 71.66,27.86 73.09,27.86 U$1.8
I_EXT_PW  (via drill 0.3)
  Top 0.152: 13.58,42.7 13.58,42.88 IC3.2 | 13.58,42.7 13.58,42.34 IC3.1 | v74.52,28.94 73.27,28.94 U$1.6 | 13.58,42.7 v11.44,42.7
  Bottom 0.152: v74.52,28.94 72.91,28.94 61.47,40.37 53.07,40.37 49.68,43.77 49.68,58.96 46.82,61.82 44.5,61.82 40.74,65.57 18.94,65.57 17.51,64.14 17.51,56.99 9.65,49.13 9.65,44.48 v11.44,42.7
I_SC  (via drill 0.3)
  Top 0.152: IC3.7 9.29,42.88 9.29,43.41 IC3.6 9.47,43.59 10.19,43.59 v11.26,44.66 | v71.48,29.47 73.09,29.47 U$1.5
  Bottom 0.152: v71.48,29.47 64.69,29.47 55.04,39.12 50.22,39.12 48.43,40.91 48.43,57.17 49.32,58.06 49.32,58.78 46.64,61.46 35.38,61.46 34.13,62.71 34.13,64.5 33.42,65.21 21.09,65.21 20.19,64.32 20.19,53.6 v11.26,44.66
N$1
  Top 0.152: R1.1 20.37,13.03 22.7,10.71 R3.2 22.87,10.53 23.23,10.17 23.23,9.28 | 23.23,9.28 23.23,6.42 R2.2 | 23.23,9.28 33.42,9.28 IC2.2
N$2
  Top 0.152: R5.2 34.85,2.67 34.85,9.1 34.13,9.82 33.6,9.82 IC2.1 33.42,9.82 32.88,9.82 32.7,9.64 26.09,9.64 23.59,12.14 22.87,12.14 R3.1
N$3
  Top 0.152: C1.1 41.64,12.85 44.67,12.85 45.39,13.57 47,13.57 47.71,12.85 R4.1
N$4
  Top 0.152: R5.1 36.45,2.67 36.45,7.85 37.17,8.57 37.53,8.57 IC2.6 37.71,8.57 40.92,8.57 45.03,12.68 46.1,12.68 R4.2
N$5
  Top 0.152: R11.1 48.43,48.59 51.64,45.38 51.64,44.48 C4.2 51.64,44.31 51.64,41.09 49.68,39.12 49.14,39.12 IC4.3
N$6  (via drill 0.3)
  Top 0.152: 15.19,42.34 14.47,43.05 14.47,43.23 14.3,43.41 13.58,43.41 IC3.3 | v20.91,48.06 22.7,49.84 R7.1 | 15.19,42.34 v16.26,43.41 | 15.19,42.34 C2.2
  Bottom 0.152: v16.26,43.41 v20.91,48.06
N$7  (via drill 0.3)
  Top 0.152: C3.2 5.18,42.88 7.5,42.88 8.76,44.13 9.29,44.13 IC3.5 9.47,44.13 10.01,44.66 v10.37,44.66 | v11.26,47.52 11.26,49.84 R9.1
  Bottom 0.152: v11.26,47.52 11.26,45.56 v10.37,44.66
N$8
  Top 0.152: IC4.5 44.85,39.84 40.74,43.95 C5.2 40.56,44.13 39.49,45.2 39.49,49.84 R13.1
N$9
  Top 0.152: R21.1 29.31,44.13 29.31,46.27 30.02,46.99 C7.2 30.2,46.99 35.38,46.99 36.45,45.91 36.45,45.38 IC6.5
N$10
  Top 0.152: 31.45,41.09 30.38,42.16 29.31,42.16 R21.2 | 31.45,41.09 34.49,41.09 IC6.1 | 31.45,41.09 30.91,40.55 30.91,34.3 R23.1
N$11
  Top 0.152: R16.1 17.87,41.62 17.87,45.02 19.84,46.99 C6.2 20.01,47.16 25.91,47.16 26.45,46.63 26.45,45.38 IC5.5
N$12
  Top 0.152: R18.1 19.3,34.3 17.87,35.73 17.87,39.66 R16.2 17.87,39.84 18.94,40.91 24.3,40.91 IC5.1
N$13
  Top 0.152: R17.1 21.27,31.8 21.27,34.12 R18.2 21.27,34.3 25.02,38.05 25.02,40.91 IC5.2
N$14
  Top 0.152: R14.1 23.41,31.8 23.41,34.12 R15.2 23.41,34.3 25.73,36.62 25.73,40.91 IC5.3
N$15
  Top 0.152: R22.1 32.7,31.8 32.7,34.12 R23.2 32.7,34.3 35.2,36.8 35.2,40.91 IC6.2
N$16
  Top 0.152: R19.1 34.85,31.8 34.85,34.12 R20.2 34.85,34.3 34.85,34.83 35.74,35.73 35.74,40.91 IC6.3
N$17
  Top 0.152: IC7.1 6.79,10.71 7.15,10.71 IC7.2
N$18
  Top 0.152: 21.8,21.79 27.88,15.71 R24.2 | 21.8,21.79 18.23,25.36 16.8,25.36 R25.1 | 21.8,21.79 13.58,13.57 10.37,13.57 8.04,11.25 8.04,10.71 IC7.3
N$19
  Top 0.152: 13.94,25.54 15.01,25.54 R25.2 | 13.94,25.54 8.04,31.44 8.04,34.12 R26.1 | 13.94,25.54 12.69,24.29 12.69,15.89 11.62,14.82 8.58,14.82 IC7.5
N$20
  Top 0.152: R27.1 16.44,18.04 15.01,16.61 13.58,16.61 R28.2 13.4,16.43 13.4,16.07 11.26,13.93 8.22,13.93 8.04,14.11 8.04,14.64 IC7.6
N$21
  Top 0.152: 6.36,13.32 7.15,14.11 7.15,14.64 IC7.7 7.33,14.82 7.33,15.36 | 6.36,13.32 6.08,13.03 6.08,10 3.93,7.85 3.93,7.31 R29.2 | 8.4,16.43 11.79,16.43 R28.1 5.08,16.51 5.08,14.61 6.36,13.32
N$22  (via drill 0.3)
  Top 0.152: 5.72,5.35 3.93,5.35 R29.1 | IC9.3 7.86,3.03 7.86,3.56 8.26,3.95 8.26,5.08 7.99,5.35 5.72,5.35 | v83.99,54.31 85.95,52.35 85.95,51.81 IC8.3 | 5.72,5.35 v5.72,8.74
  Bottom 0.152: v83.99,54.31 65.4,54.31 55.75,63.96 55.75,64.5 54.33,65.93 16.8,65.93 15.01,64.14 15.01,55.03 1.9,41.92 1.91,41.91 1.91,15.88 3.81,13.97 5.71,13.97 5.71,12.07 5.72,12.07 | v5.72,8.74 5.72,12.07 | 5.72,12.07 5.72,12.5
N$23  (via drill 0.3)
  Top 0.152: R32.2 53.43,18.75 53.43,19.29 55.04,20.9 55.04,21.97 53.43,23.58 R31.1 53.25,23.58 53.07,23.4 48.43,23.4 R30.1 48.25,23.22 47.53,22.5 v47.53,22.15 | v45.21,19.82 43.96,19.82 41.64,17.5 41.64,16.96 IC10.2
  Bottom 0.152: v47.53,22.15 v45.21,19.82
N$24
  Top 0.152: R32.1 53.43,16.79 53.43,14.64 54.5,13.57 C8.2
N$25
  Top 0.152: R33.2 40.74,7.31 45.57,7.31 50.04,11.78 54.5,11.78 C8.1 54.68,11.96 55.4,12.68 55.4,23.22 53.97,24.65 52.72,24.65 52.18,24.11 47.53,24.11 40.92,17.5 40.92,16.96 IC10.1
N$26  (via drill 0.3)
  Top 0.152: v30.91,24.11 33.42,26.61 R34.1 | v29.13,6.24 29.13,6.06 30.02,5.17 R35.2 | v37.53,5.53 40.56,5.53 R33.1
  Bottom 0.152: v30.91,24.11 30.38,24.11 | 30.38,24.11 26.09,24.11 U$11.1 | 30.38,24.11 30.38,16.07 28.41,14.11 28.41,6.96 v29.13,6.24 29.84,5.53 v37.53,5.53
N$27
  Top 0.152: 85.09,35.56 83.76,34.23 U$1.63
  Top 0.305: R48.2 85.09,35.56
N$29  (via drill 0.3)
  Top 0.152: v18.41,14.11 17.16,14.11 16.62,13.57 R42.1
  Bottom 0.152: v18.41,14.11 24.84,20.54 24.84,20.9 U$11.8
N$30  (via drill 0.3, 0.6)
  Top 0.152: v26.63,14.11 26.63,12.32 C10.2 | v26.63,18.93 26.63,19.47 19.12,26.97 R36.2 18.94,27.15 16.26,27.15 15.19,28.22 12.87,28.22 R44.1 | v21.59,19.05 22.86,19.05 v25.4,16.51
  Bottom 0.152: v26.63,18.93 26.63,15.24 | 26.63,15.24 v26.63,14.11 | U$11.9 24.38,20.57 22.86,19.05 v21.59,19.05 | v25.4,16.51 25.4,16.47 26.63,15.24
N$31
  Top 0.152: C13.2 29.48,12.85 29.48,20.72 28.06,22.15 28.06,23.4 31.27,26.61 R38.2
N$32  (via drill 0.3)
  Top 0.152: v28.77,22.32 32.88,22.32 R37.1
  Bottom 0.152: v28.77,22.32 28.59,22.15 26.09,22.15 U$11.5
N$33
  Bottom 0.305: U$11.6 28.79,21.59 C11.2
N$34
  Top 0.152: U$15.3 66.12,44.31 66.3,44.48 66.3,47.52 R80.2 66.48,47.7 66.66,47.88 66.66,51.99 U$17.4
N$35
  Bottom 0.152: R60.2 56.29,2.67 53.61,2.67 52.18,4.1 C18.2
N$36  (via drill 0.3)
  Top 0.152: v27.7,24.83 29.48,26.61 R38.1
  Bottom 0.152: v27.7,24.83 25.38,24.83 U$11.24
N$37  (via drill 0.3)
  Top 0.152: v8.22,8.74 8.22,8.03 8.04,7.85 8.04,7.31 IC9.6 7.86,7.31 7.33,7.31 IC9.7
  Bottom 0.152: v8.22,8.74 8.4,8.92 22.7,8.92 30.02,16.25 30.02,21.97 28.41,23.58 26.09,23.58 U$11.2
N$38  (via drill 0.3)
  Top 0.152: v49.32,25.01 54.68,25.01 55.75,23.93 55.75,19.82 58.26,17.32 58.26,16.96 R45.2 | v45.39,23.75 42.89,21.25 IC10.5 42.89,21.07 42.89,20.54 42.17,19.82 41.64,19.82 39.67,17.86 36.45,17.86 R40.2
  Bottom 0.152: v49.32,25.01 46.64,25.01 v45.39,23.75
N$39
  Top 0.152: 38.96,21.97 38.24,21.97 R41.2 | 38.96,21.97 40.74,20.18 41.82,20.18 42.17,20.54 42.17,21.07 IC10.6 | 38.96,21.97 39.85,22.86 39.85,24.65 41.28,26.08 41.82,26.08 R43.1
N$40
  Top 0.152: R9.2 11.26,51.63 10.37,51.63 9.65,50.92 U$2.4
N$41
  Top 0.152: R11.2 46.82,50.38 46.46,50.74 U$4.4
N$42
  Top 0.152: R7.2 22.7,51.63 21.8,51.63 21.09,50.92 U$3.4
N$43
  Top 0.152: R13.2 39.31,51.63 36.99,51.63 36.28,50.92 U$5.4
N$44
  Top 0.152: IC8.1 87.38,51.81 89.89,51.81 92.92,54.85 U$6.1
N$45  (via drill 0.3)
  Top 0.152: v3.93,8.74 3.75,8.74 2.86,7.85 2.86,4.99 4.83,3.03 6.61,3.03 IC9.1
  Bottom 0.152: v3.93,8.74 3.93,12.32 U$7.1
N$46  (via drill 0.6 pad 0.3)
  Top 0.152: IC9.2 7.29,4.14 6.99,4.45 v5.08,4.45
  Bottom 0.152: 6.43,6.35 6.43,5.17 U$7.3 | 6.43,6.35 6.43,7.85 8.04,9.46 17.16,9.46 18.76,11.07 18.76,12.32 DISSIP2.2 | v5.08,4.45 5.08,5.08 6.35,6.35 6.43,6.35
N$47
  Top 0.152: IC8.2 86.67,51.81 86.67,54.31 87.21,54.85 DISSIP1.2 87.38,55.03 88.1,55.03 95.25,62.17 U$6.3
N$48
  Top 0.152: C14.1 68.62,27.69 69.69,27.69 Q1.2 69.87,27.51 71.48,25.9 73.09,25.9 U$1.12
  Top 0.305: 68.58,27.52 C14.1
N$49
  Top 0.152: C20.1 71.12,20 73.09,21.97 U$1.20
N$50
  Top 0.152: C15.1 67.37,25.72 69.69,25.72 Q1.1 69.87,25.72 70.23,25.36 73.09,25.36 U$1.13
  Top 0.305: 67.31,25.82 C15.1
N$51
  Top 0.152: IC11.7 78.45,5.53 79.7,5.53 81.31,3.92 82.92,3.92 R54.2 83.1,3.92 88.46,9.28 88.81,9.28 C16.1
N$52
  Top 0.152: 68.44,10.53 67.01,9.1 67.01,7.67 R49.1 | 68.44,10.53 73.45,5.53 73.98,5.53 IC11.2 | 68.44,10.53 R50.2
N$53
  Top 0.152: 72.55,8.21 73.98,6.78 73.98,6.06 IC11.1 | 72.55,8.21 68.62,12.14 R50.1 | 72.55,8.21 77.02,12.68 78.98,12.68 R51.2
N$54  (via drill 0.3)
  Top 0.152: R52.2 85.06,14.82 v83.81,13.57 83.1,12.85 80.95,12.85 R51.1 80.77,12.68 80.77,12.32 79.52,11.07 v79.52,8.39 | v79.52,4.81 78.45,4.81 IC11.6
  Bottom 0.152: v83.81,13.57 R53.2 | v79.52,8.39 v79.52,4.81
N$55
  Top 0.152: C16.2 88.81,11.07 87.21,11.07 85.24,13.03 R52.1
N$56
  Bottom 0.152: R58.2 84.7,10.89 82.56,13.03 R53.1 82.38,13.03 80.59,11.25 79.7,11.25 IC12.1
N$57
  Top 0.152: R55.2 89.17,3.92 84.7,3.92 R54.1 84.53,3.74 83.1,2.31 62.01,2.31 | 62.01,2.31 61.83,2.13 55.4,2.13 53.43,4.1 R56.1 | 62.01,2.31 62.19,2.49 62.19,3.2 62.01,3.38 61.47,3.38 LTC3411.9
N$58  (via drill 0.3)
  Top 0.152: v92.39,3.74 91.14,3.74 R55.1
  Bottom 0.152: 92.39,5.08 v92.39,3.74 | R71.1 92.21,9.28 93.46,9.28 93.82,8.92 C17.+ 93.82,8.74 93.82,5.71 R57.2
  Bottom 1.27: R57.2 92.39,5.08 91.27,5.08 L2.2
N$59  (via drill 0.3)
  Top 0.152: v59.15,2.85 61.29,2.85 LTC3411.10
  Bottom 0.152: v59.15,2.85 58.26,2.85 58.08,2.67 R60.1
N$60  (via drill 0.3)
  Top 0.152: v68.44,6.78 66.12,6.78 63.8,4.46 63.8,4.1 64.51,3.38 65.58,3.38 LTC3411.2
  Bottom 0.152: v68.44,6.78 69.69,8.03 R61.2 69.87,8.21 71.3,9.64 72.37,9.64 R64.1
N$61
  Bottom 0.152: R71.2 92.03,10.89 86.67,10.89 R58.1 86.49,10.71 85.6,9.82 84.35,9.82 83.63,10.53 79.7,10.53 IC12.2
N$62  (via drill 0.3)
  Top 0.152: v64.87,6.42 63.44,4.99 63.44,3.92 64.51,2.85 65.58,2.85 LTC3411.1
  Bottom 0.152: v64.87,6.42 66.48,8.03 67.19,8.03 R59.1
N$63  (via drill 0.3)
  Top 0.152: v82.2,6.6 83.1,7.49 R63.2 82.92,7.67 v80.77,9.82
  Bottom 0.152: IC12.3 79.7,9.82 v80.77,9.82 80.64,9.53 81.92,9.53 81.92,3.81 R62.2
N$64  (via drill 0.3)
  Top 0.152: v57.01,6.24 59.51,3.74 61.29,3.74 LTC3411.8
  Bottom 0.152: v57.01,6.24 56.29,6.24 55.93,6.6 R65.2
N$65  (via drill 0.3)
  Top 0.152: v57.36,9.82 54.86,7.31 47,7.31 R70.2
  Bottom 0.152: v57.36,9.82 61.83,9.82 62.19,10.17 U$8.3 62.37,10.17 62.72,9.82 67.19,9.82 R59.2
N$75  (via drill 0.3)
  Top 0.152: C9.+ 16.62,28.94 18.94,28.94 R36.1 19.12,28.76 v23.23,28.76 | v29.13,7.14 28.41,6.42 28.41,5.17 R35.1 | v38.24,28.58 38.24,23.75 R41.1
  Bottom 0.152: v29.13,7.14 33.42,7.14 50.04,23.75 50.04,31.26 49.32,31.97 44.85,31.97 R39.2 | v38.24,28.58 38.24,29.21 | v23.23,28.76 23.77,28.49
  Bottom 0.305: U$11.20 23.37,26.16 22.86,26.67 | U$11.19 22.86,26.67 | 22.86,26.67 22.23,26.04 U$11.18 U$11.17
  Bottom 1.27: 22.86,26.67 23.77,28.49 24.13,29.21 38.24,29.21 41.91,29.21 44.3,31.6 R39.2
N$77  (via drill 0.3)
  Top 0.152: v64.51,4.28 65.58,4.28 LTC3411.4
  Bottom 0.152: 72.55,4.28 v64.51,4.28 64.77,4.45 66.67,2.54 83.19,2.54 84.45,3.81 84.53,3.81 | 84.53,3.81 84.53,5.71 L2.1 | 84.53,3.81 84.53,3.38
N$78
  Bottom 0.305: U$11.16 20.57,23.11 20.32,22.86 20.57,22.61 | U$11.15 20.57,22.61 | U$11.14 21.08,22.1 20.57,22.61
  Bottom 1.27: L1.2 20.32,22.86
N$79
  Top 0.152: U$13.3 57.18,44.31 57.54,44.66 57.54,47.52 R81.2 57.72,47.7 57.72,51.99 U$16.4
N$80
  Top 0.152: U$14.3 75.05,44.31 75.23,44.48 75.23,47.52 R79.2 75.41,47.7 75.41,51.99 U$18.4
RST/SBWTDIO
  Top 0.152: JP7.1 90.17,36.83 89.53,37.47 80.01,37.47 77.26,34.72 U$1.76
SC+
  Top 0.152: U$2.8 5.54,56.1 5.54,57.53 5.18,57.89 R8.1
  Top 1.27: SC_TOP.2 SC_TOP.1 11.43,60.96 5.08,60.96 | R8.1 5.08,58.84 5.08,60.96 | 5.08,60.96 SC_BOT.2 SC_BOT.1
TEST/SBWTCK
  Top 0.152: JP7.2 91.44,34.29 88.9,36.83 81.28,36.83 79.76,35.31 U$1.71
UUU
  Top 0.152: IC10.7 41.64,21.25 41.64,21.79 41.82,21.97 41.82,24.47 R43.2 41.99,24.65 42.17,24.83 48.25,24.83 R30.2
V_BT_MS  (via drill 0.3)
  Top 0.152: IC6.7 35.38,45.38 35.74,45.38 IC6.6 35.92,45.2 35.92,44.66 v36.45,44.13 | v50.75,36.98 63.62,36.98 69.69,30.9 73.09,30.9 U$1.2 | v48.61,36.98 45.93,39.66 45.93,39.84 v41.82,43.95
  Bottom 0.152: v48.61,36.98 v50.75,36.98 | v41.82,43.95 36.63,43.95 v36.45,44.13
V_BUS_MS  (via drill 0.3)
  Top 0.152: 25.73,45.38 25.2,45.38 IC5.7 | v45.75,48.24 47,49.49 48.96,49.49 52.54,45.91 52.54,44.13 55.93,40.73 60.4,40.73 69.69,31.44 73.09,31.44 U$1.1 | 25.73,45.38 v25.73,46.45 | 25.73,45.38 IC5.6
  Bottom 0.152: v45.75,48.24 45.39,48.24 43.6,46.45 v25.73,46.45
VCC  (via drill 0.3, 0.5, 0.6, 0.6 pad 0.3)
  Top 0.152: 68.08,44.66 66.66,43.23 65.4,43.23 61.12,47.52 59.33,47.52 R81.1 59.15,47.52 59.15,44.66 57.72,43.23 56.47,43.23 49.14,50.56 49.14,51.1 48.07,52.17 43.42,52.17 42.71,51.45 42.71,50.92 U$4.1 | 68.08,44.66 68.08,47.52 R80.1 | U$6.2 97.39,54.85 94.71,54.85 87.38,47.52 IC8.8 87.21,47.52 87.21,48.06 86.67,48.59 82.56,48.59 C_IC8.2 82.38,48.59 81.49,47.7 77.2,47.7 R79.1 77.02,47.52 77.02,44.66 75.59,43.23 74.34,43.23 72.91,44.66 68.08,44.66 | U$2.6 8.22,56.1 8.22,57.89 R8.2 | 17.16,52.52 17.16,55.92 U$3.8 16.98,56.1 16.62,56.46 16.62,57.89 R6.1 | 17.16,52.52 17.16,50.92 U$3.1 | C_IC4.2 46.1,41.98 46.1,46.45 42.71,49.84 42.71,50.74 U$4.1 | 24.12,45.02 24.3,45.2 IC5.8 | 24.12,45.02 23.23,44.13 22.34,44.13 C_IC5.2 | 28.06,48.24 26.98,47.16 26.98,44.66 26.63,44.31 24.84,44.31 24.12,45.02 | 28.06,48.24 30.56,50.74 32.34,50.74 U$5.1 32.52,50.92 32.52,51.45 33.24,52.17 35.38,52.17 35.56,51.99 35.56,49.49 35.74,49.31 36.63,49.31 | 36.63,49.31 38.06,50.74 42.53,50.74 U$4.1 | 17.16,52.52 23.77,52.52 28.06,48.24 | 50.57,32.69 51.11,32.15 51.47,32.15 51.82,31.8 | 50.57,32.69 45.57,37.69 45.03,37.69 IC4.8 | 51.82,31.8 51.82,30.19 51.29,29.65 50.93,29.65 U$19.3 | 64.33,31.62 67.37,31.62 72.19,26.79 72.19,26.61 72.37,26.43 73.09,26.43 U$1.11 | 64.33,31.62 63.08,31.62 C21.1 62.9,31.8 62.01,32.69 53.25,32.69 52.36,31.8 51.82,31.8 | R63.1 84.53,7.49 82.92,5.89 78.63,5.89 78.45,6.06 IC11.8 78.27,6.06 77.2,7.14 77.2,8.21 C_IC11.2 77.02,8.39 v77.02,10 | v63.98,25.54 62.37,27.15 FERRITE_BEAD.1 | v64.33,27.51 64.33,31.62 | v4.47,14.64 3.93,14.11 3.93,13.57 C_IC7.2 | v6.79,9.46 6.79,7.31 IC9.8
  Top 0.152: v5.9,14.64 6.61,14.64 IC7.8 | 10.01,45.91 5.72,50.2 U$2.1 | 10.01,45.91 10.19,45.73 10.54,45.73 C_IC3.2 | v8.22,41.8 8.58,42.16 9.29,42.16 IC3.8 | v8.94,44.84 10.01,45.91 | IC2.8 37.53,10 36.45,11.07 36.45,11.43 C_IC2.2 36.28,11.6 36.28,16.43 35.56,17.14 35.56,21.07 37.35,22.86 38.78,22.86 39.49,23.58 39.49,25.36 41.28,27.15 42.35,27.15 | 43.42,26.26 42.53,25.36 41.1,25.36 40.92,25.18 40.92,21.25 IC10.8 | 43.42,26.26 44.14,26.97 46.82,26.97 C27.2 | 42.35,27.15 42.53,27.15 43.42,26.26 | 11.79,9.28 15.19,12.68 17.87,12.68 20.19,15 R1.2 20.37,14.82 28.59,14.82 28.95,15.18 28.95,16.43 28.06,17.32 R24.1 27.88,17.5 27.88,21.79 24.84,24.83 24.84,27.15 v24.77,27.31 | 11.79,9.28 11.44,8.92 11.44,6.06 C_IC9.2 | IC6.8 34.49,45.2 33.42,44.13 31.81,44.13 C_IC6.2 31.63,43.95 30.74,43.95 30.02,43.23 28.59,43.23 28.23,42.88 28.23,35.37 30.91,32.69 31.45,32.69 31.81,32.33 31.81,31.08 31.63,30.9 | v45.39,20.9 46.28,20 C_IC10.2 | 24.77,30.9 31.63,30.9 | 42.35,27.15 42.35,31.97 41.64,32.69 35.74,32.69 35.56,32.51 | 35.56,32.51 35.56,31.08 35.38,30.9 31.63,30.9 | 11.79,9.28 v10.9,10.17 | v47.89,30.01 50.57,32.69 | 36.63,49.31 36.63,46.99 37.53,46.09 37.53,38.94 36.1,37.52 36.1,35.55 35.56,35.01 35.56,32.51 | v90.17,15.24 90.17,13.97
  Top 0.305: v24.77,27.31 24.77,30.9 24.77,31.54 R14.2
  Top 1.27: R6.1 R8.2 | v96.52,2.54 95.25,2.54 | v6.35,17.78 7.62,17.78
  Bottom 0.152: U$11.21 23.88,26.42 v24.77,27.31 24.84,27.15 28.77,27.15 35.02,20.9 44.67,20.9 | v77.02,10 75.95,11.07 75.41,11.07 IC12.8 75.23,11.25 71.66,11.25 69.87,13.03 69.87,14.82 69.51,15.18 67.55,15.18 63.8,11.43 62.55,11.43 62.37,11.6 62.37,13.57 69.34,20.54 | 64.33,25.54 v63.98,25.54 | 69.34,20.54 76.48,13.39 C_IC12.2 76.66,13.39 78.98,15.71 89.7,15.71 v90.17,15.24 | 69.34,20.54 64.33,25.54 | 96.5,5.17 R57.1 | 64.33,25.54 v64.33,27.51 | v4.47,14.64 v5.9,14.64 6.43,14.64 8.58,12.5 U$7.2 | v6.79,9.46 6.79,10.53 8.58,12.32 U$7.2 | 4.65,28.58 5,28.94 C12.+ 5,29.12 3.93,30.19 3.93,32.87 8.22,37.16 v8.22,41.8 8.94,42.52 v8.94,44.84 | 4.65,22.86 L1.1 | 44.67,20.9 v45.39,20.9 | v10.9,10.17 8.76,12.32 U$7.2 | v47.89,30.01 47.89,27.15 44.67,23.93 44.67,20.9
  Bottom 1.27: 96.5,5.17 v96.52,2.54 | L1.1 4.62,19.51 v6.35,17.78
  pour Top: 0,67.31 100.33,67.31 100.33,0 0,0
VREF  (via drill 0.3)
  Top 0.152: v79.52,3.56 78.98,3.56 78.45,4.1 IC11.5 | v72.91,4.81 73.98,4.81 IC11.3 74.16,4.81 74.7,4.81 75.05,5.17 75.05,6.96 74.52,7.49 74.52,8.92 77.38,11.78 79.7,11.78 80.06,12.14 80.06,13.39 77.02,16.43 60.58,16.43 58.44,18.57 R45.1 58.26,18.75 58.26,27.15 57.18,28.22 C28.2 57.01,28.22 52.36,28.22 v52.18,28.04 | v17.69,18.75 16.62,19.82 R27.2 | v17.69,10.89 17.69,9.82 23.41,4.1 30.91,4.1 31.27,4.46 | 31.27,4.46 34.49,7.67 34.49,8.03 33.95,8.57 33.6,8.57 IC2.3 | 31.27,4.46 34.13,1.6 36.99,1.6 37.35,1.95 37.35,3.2 36.81,3.74 36.81,5.71 37.53,6.42 37.53,7.85 IC2.5 37.71,7.85 v38.96,7.85 | v42.17,15 42.17,16.79 IC10.3 | v52.18,29.47 53.25,29.47 U$19.4
  Bottom 0.152: v72.91,4.81 78.27,4.81 v79.52,3.56 79.38,3.81 R62.1 | v17.69,10.89 v17.69,18.75 | v38.96,7.85 42.17,11.07 v42.17,15 52.18,25.01 v52.18,28.04 v52.18,29.47

### Text on the board
tPlace: SC+_BOT | GND | SC+_TOP | GND | GND | BT_IN | EXT1 | GND | EXT2 | GND | EXT3 | GND | AN4 | AN3 | AN2 | AN1 | RST | TEST | SDA | SCL